# Altium project FPGA3.PrjPCB (part 1 of 2)
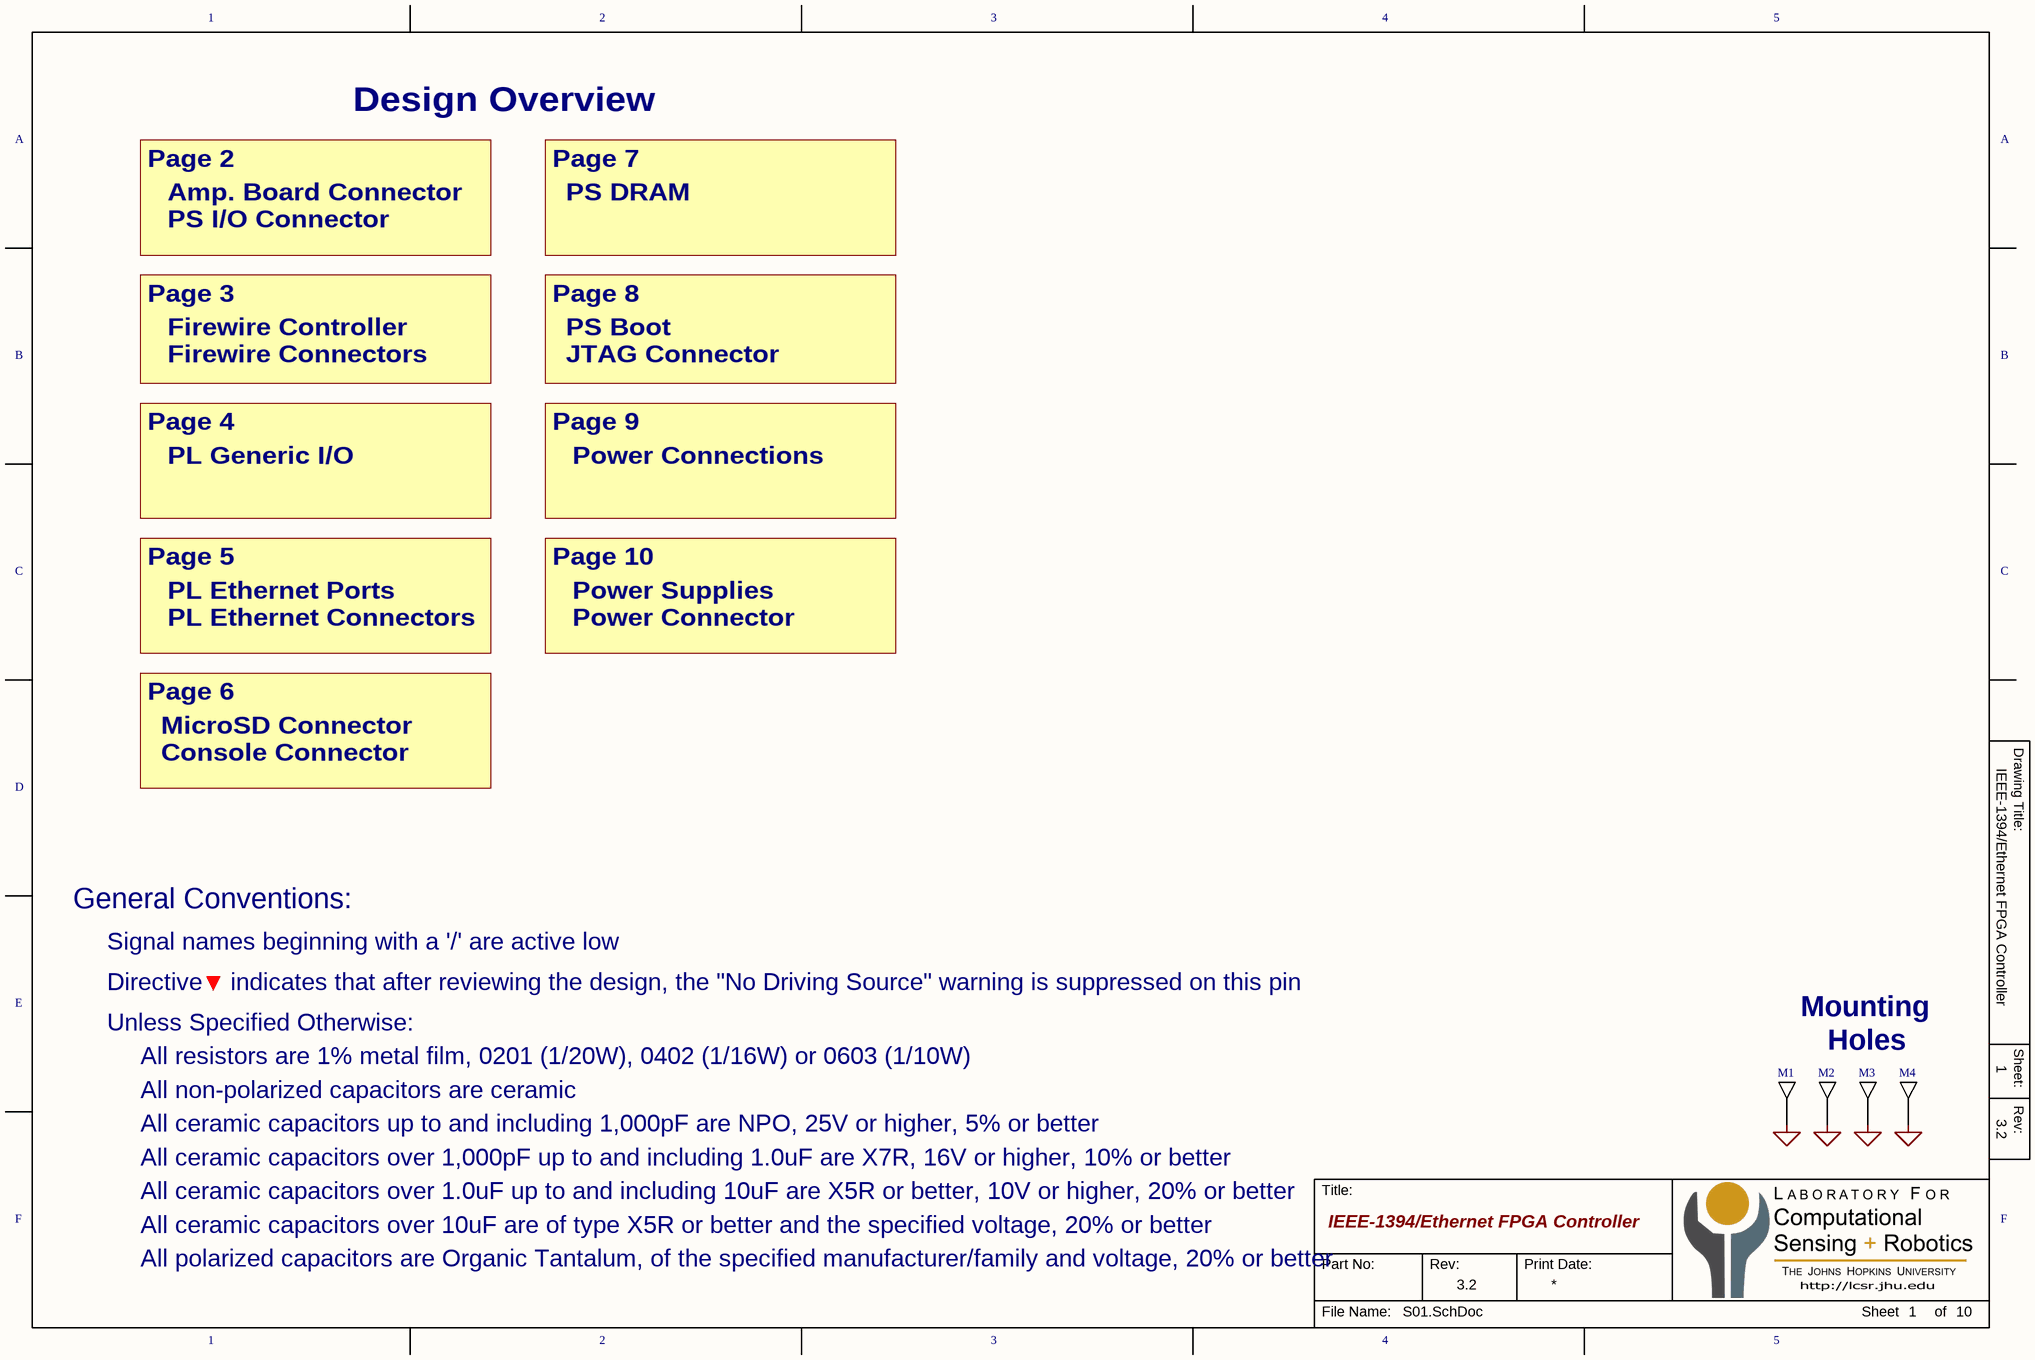
[diagram p0: S01.SchDoc]
10 sheets, 420 parts. Net scope: flat (ports and power ports of the same name join across sheets).
Board file: FPGA3.PcbDoc
Sheets:
  S01.SchDoc
  S02.SchDoc
  S03.SchDoc
  S04.SchDoc
  S05.SchDoc
  S06.SchDoc
  S07.SchDoc
  S08.SchDoc
  S09.SchDoc
  S10.SchDoc

## Sheet S01.SchDoc: IEEE-1394/Ethernet FPGA Controller
size 381 x 254 mm; Revision: 3.2; SheetNumber: 1; SheetTotal: 10; PageSetup: Record=PageOptions|CenterHorizontal=True|CenterVertical=True|PrintScale=1.08|XCorrection=1.00|YCorrection=1.00|PrintKind=1|BorderSize=5000000|LeftOffset=0|BottomOffset=0|Orientation=2|PaperLength=1000|PaperWidth=1000|Scale=100|PaperSource=7|PrintQuality=600|MediaType=1|DitherType=10|PrintScaleMode=1|PaperKind=Ledger|PaperIndex=3

### Parts
M1  MHOLE  [MHOLE4]  (value not drawn)  (no BOM)
M2  MHOLE  [MHOLE4]  (value not drawn)  (no BOM)
M3  MHOLE  [MHOLE4]  (value not drawn)  (no BOM)
M4  MHOLE  [MHOLE4]  (value not drawn)  (no BOM)

### Nets
GND: M1.1 M2.1 M3.1 M4.1

### Notes on the sheet
- Page 2
- Design Overview
- Page 7
- Amp. Board Connector
- PS I/O Connector
- PS DRAM
- Page 3
- Page 8
- Firewire Controller
- Firewire Connectors
- PS Boot
- JTAG Connector
- Page 4
- Page 9
- PL Generic I/O
- Power Connections
- Page 5
- Page 10
- PL Ethernet Connectors
- PL Ethernet Ports
- Power Connector
- Power Supplies
- Page 6
- Console Connector
- MicroSD Connector
- General Conventions:
- Signal names beginning with a '/' are active low
- Unless Specified Otherwise:
- Directive    indicates that after reviewing the design, the "No Driving Source" warning is suppressed on this pin
- Mounting
- All resistors are 1% metal film, 0201 (1/20W), 0402 (1/16W) or 0603 (1/10W)
- All non-polarized capacitors are ceramic
- Holes
- All ceramic capacitors up to and including 1,000pF are NPO, 25V or higher, 5% or better
- All ceramic capacitors over 1,000pF up to and including 1.0uF are X7R, 16V or higher, 10% or better
- All ceramic capacitors over 10uF are of type X5R or better and the specified voltage, 20% or better
- All ceramic capacitors over 1.0uF up to and including 10uF are X5R or better, 10V or higher, 20% or better
- All polarized capacitors are Organic Tantalum, of the specified manufacturer/family and voltage, 20% or better
- 1
- 2
- 3
- 4
- 5
- A
- B
- C
- Drawing Title:
- D
- E
- Sheet:
- Rev:
- F
- Title:
- Part No:
- Print Date:
- File Name:
- Sheet
- of

### Library data of the parts
M1-M4 = MHOLE: Mounting Hole

## Sheet S02.SchDoc: IEEE-1394/Ethernet FPGA Controller
size 381 x 254 mm; Revision: 3.2; SheetNumber: 2; SheetTotal: 10
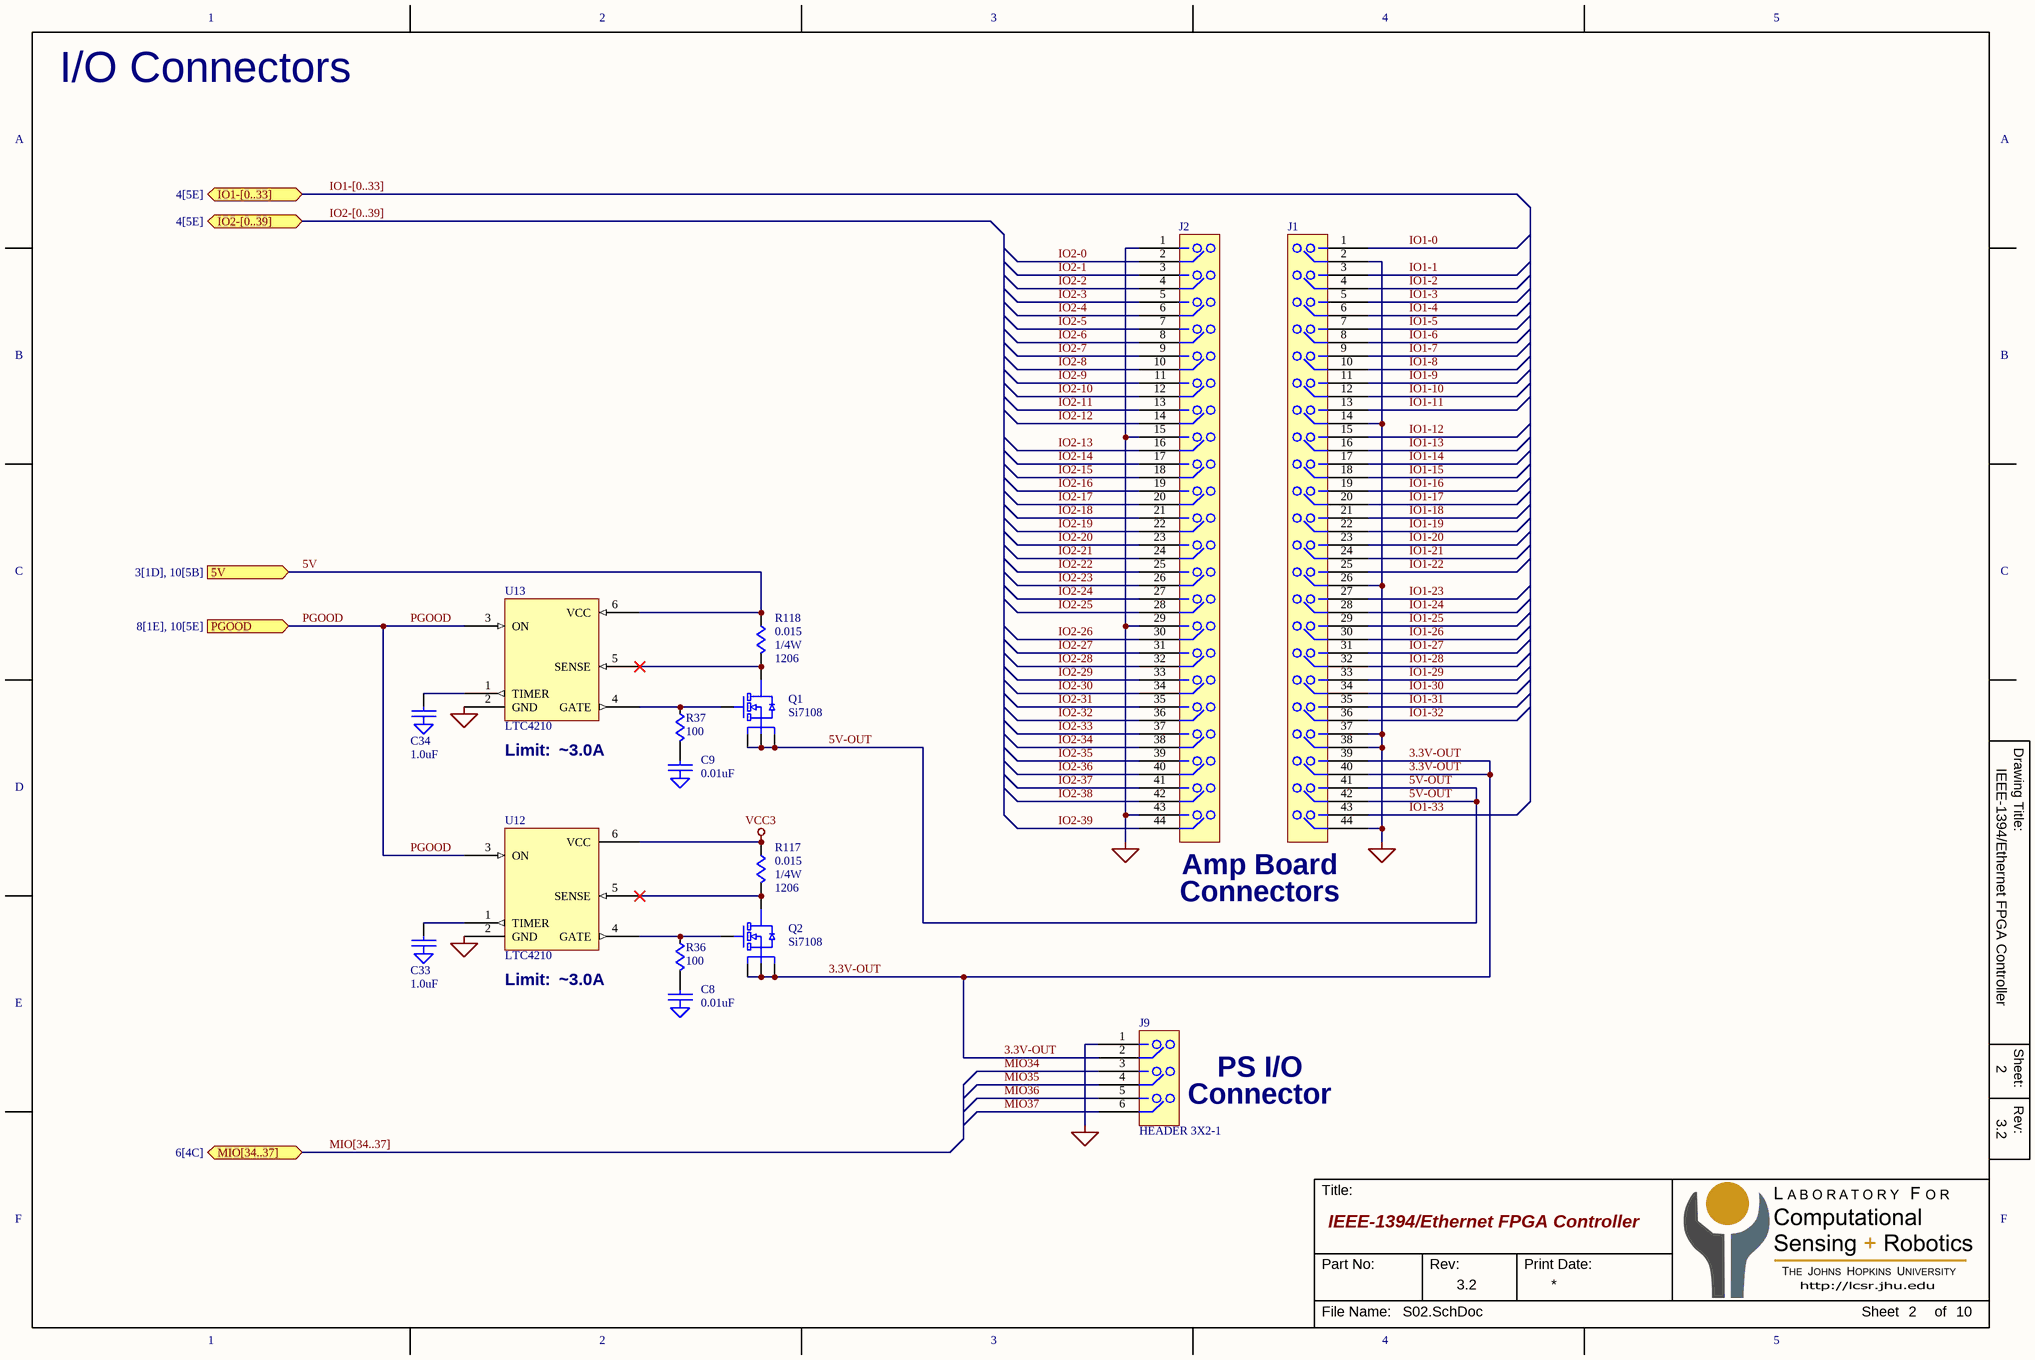
[diagram p1: S02.SchDoc]

### Parts
C8  0.01uF  [C0402]
C9  0.01uF  [C0402]
C33  1.0uF  [C0402]
C34  1.0uF  [C0402]
J1  HEADER 22x2-1  [HDR-22x2-2MM]  (value not drawn)
J2  HEADER 22x2-1  [HDR-22x2-2MM]  (value not drawn)
J9  HEADER 3X2-1  [HDR-3x2-2MM]
Q1  Si7108  [PowerPak-1212]
Q2  Si7108  [PowerPak-1212]
R36  100  [R0402]
R37  100  [R0402]
R117  0.015  Power: 1/4W  Type: 1206  [R1206]
R118  0.015  Power: 1/4W  Package: 1206  [R1206]
U12  LTC4210  [SOT-23-6]
U13  LTC4210  [SOT-23-6]

### Ports
5V (in, see 3[1D], 10[5B]), IO1-[0..33] (bidir, see 4[5E]), IO2-[0..39] (bidir, see 4[5E]), MIO[34..37] (bidir, see 6[4C]), PGOOD (in, see 8[1E], 10[5E])

### Nets
GND: C8.2(GND) C9.2(GND) C33.2(GND) C34.2(GND) J1.2 J1.14 J1.26 J1.37 J1.38 J1.44 J2.1 J2.15 J2.29 J2.43 J9.1 U12.2(GND) U13.2(GND)
VCC3: R117.1 U12.6(VCC)
3.3V-OUT: J1.39 J1.40 J9.2 Q2.1(S) Q2.2(S) Q2.3(S)  [project net 3.3V-OUT_2]
5V: R118.1 U13.6(VCC) ; port 5V
5V-OUT: J1.41 J1.42 Q1.1(S) Q1.2(S) Q1.3(S)  [project net 5V-OUT_2]
IO1-0: J1.1
IO1-1: J1.3
IO1-2: J1.4
IO1-3: J1.5
IO1-4: J1.6
IO1-5: J1.7
IO1-6: J1.8
IO1-7: J1.9
IO1-8: J1.10
IO1-9: J1.11
IO1-10: J1.12
IO1-11: J1.13
IO1-12: J1.15
IO1-13: J1.16
IO1-14: J1.17
IO1-15: J1.18
IO1-16: J1.19
IO1-17: J1.20
IO1-18: J1.21
IO1-19: J1.22
IO1-20: J1.23
IO1-21: J1.24
IO1-22: J1.25
IO1-23: J1.27
IO1-24: J1.28
IO1-25: J1.29
IO1-26: J1.30
IO1-27: J1.31
IO1-28: J1.32
IO1-29: J1.33
IO1-30: J1.34
IO1-31: J1.35
IO1-32: J1.36
IO1-33: J1.43
IO2-0: J2.2
IO2-1: J2.3
IO2-2: J2.4
IO2-3: J2.5
IO2-4: J2.6
IO2-5: J2.7
IO2-6: J2.8
IO2-7: J2.9
IO2-8: J2.10
IO2-9: J2.11
IO2-10: J2.12
IO2-11: J2.13
IO2-12: J2.14
IO2-13: J2.16
IO2-14: J2.17
IO2-15: J2.18
IO2-16: J2.19
IO2-17: J2.20
IO2-18: J2.21
IO2-19: J2.22
IO2-20: J2.23
IO2-21: J2.24
IO2-22: J2.25
IO2-23: J2.26
IO2-24: J2.27
IO2-25: J2.28
IO2-26: J2.30
IO2-27: J2.31
IO2-28: J2.32
IO2-29: J2.33
IO2-30: J2.34
IO2-31: J2.35
IO2-32: J2.36
IO2-33: J2.37
IO2-34: J2.38
IO2-35: J2.39
IO2-36: J2.40
IO2-37: J2.41
IO2-38: J2.42
IO2-39: J2.44
MIO34: J9.3
MIO35: J9.4
MIO36: J9.5
MIO37: J9.6
PGOOD: U12.3(ON) U13.3(ON) ; port PGOOD
NetC8_1: C8.1 R36.2
NetC9_1: C9.1 R37.2
NetC33_1: C33.1 U12.1(TIMER)
NetC34_1: C34.1 U13.1(TIMER)
NetQ1_4: Q1.4(G) R37.1 U13.4(GATE)
NetQ1_5: Q1.5(D) R118.2 U13.5(SENSE)
NetQ2_4: Q2.4(G) R36.1 U12.4(GATE)
NetQ2_5: Q2.5(D) R117.2 U12.5(SENSE)

### Buses and harness runs
bus IO1-[0..33] = port IO1-[0..33]
bus IO2-[0..39] = port IO2-[0..39]
bus MIO[34..37] = port MIO[34..37]

### Notes on the sheet
- I/O Connectors
- (near U13) Limit:
- (near U13) ~3.0A
- Amp Board
- Connectors
- (near U12) Limit:
- (near U12) ~3.0A
- PS I/O
- Connector
- 1
- 2
- 3
- 4
- 5
- A
- B
- C
- Drawing Title:
- D
- E
- Sheet:
- Rev:
- F
- Title:
- Part No:
- Print Date:
- File Name:
- Sheet
- of

### Library data of the parts
C8 C9 C33 C34 = CAP-GND
Q1 Q2 = MOSFET-N-PPACK
R36 R37 = R-MINI
R117 R118 = R

## Sheet S03.SchDoc: IEEE-1394/Ethernet FPGA Controller
size 381 x 254 mm; Revision: 3.2; SheetNumber: 3; SheetTotal: 10
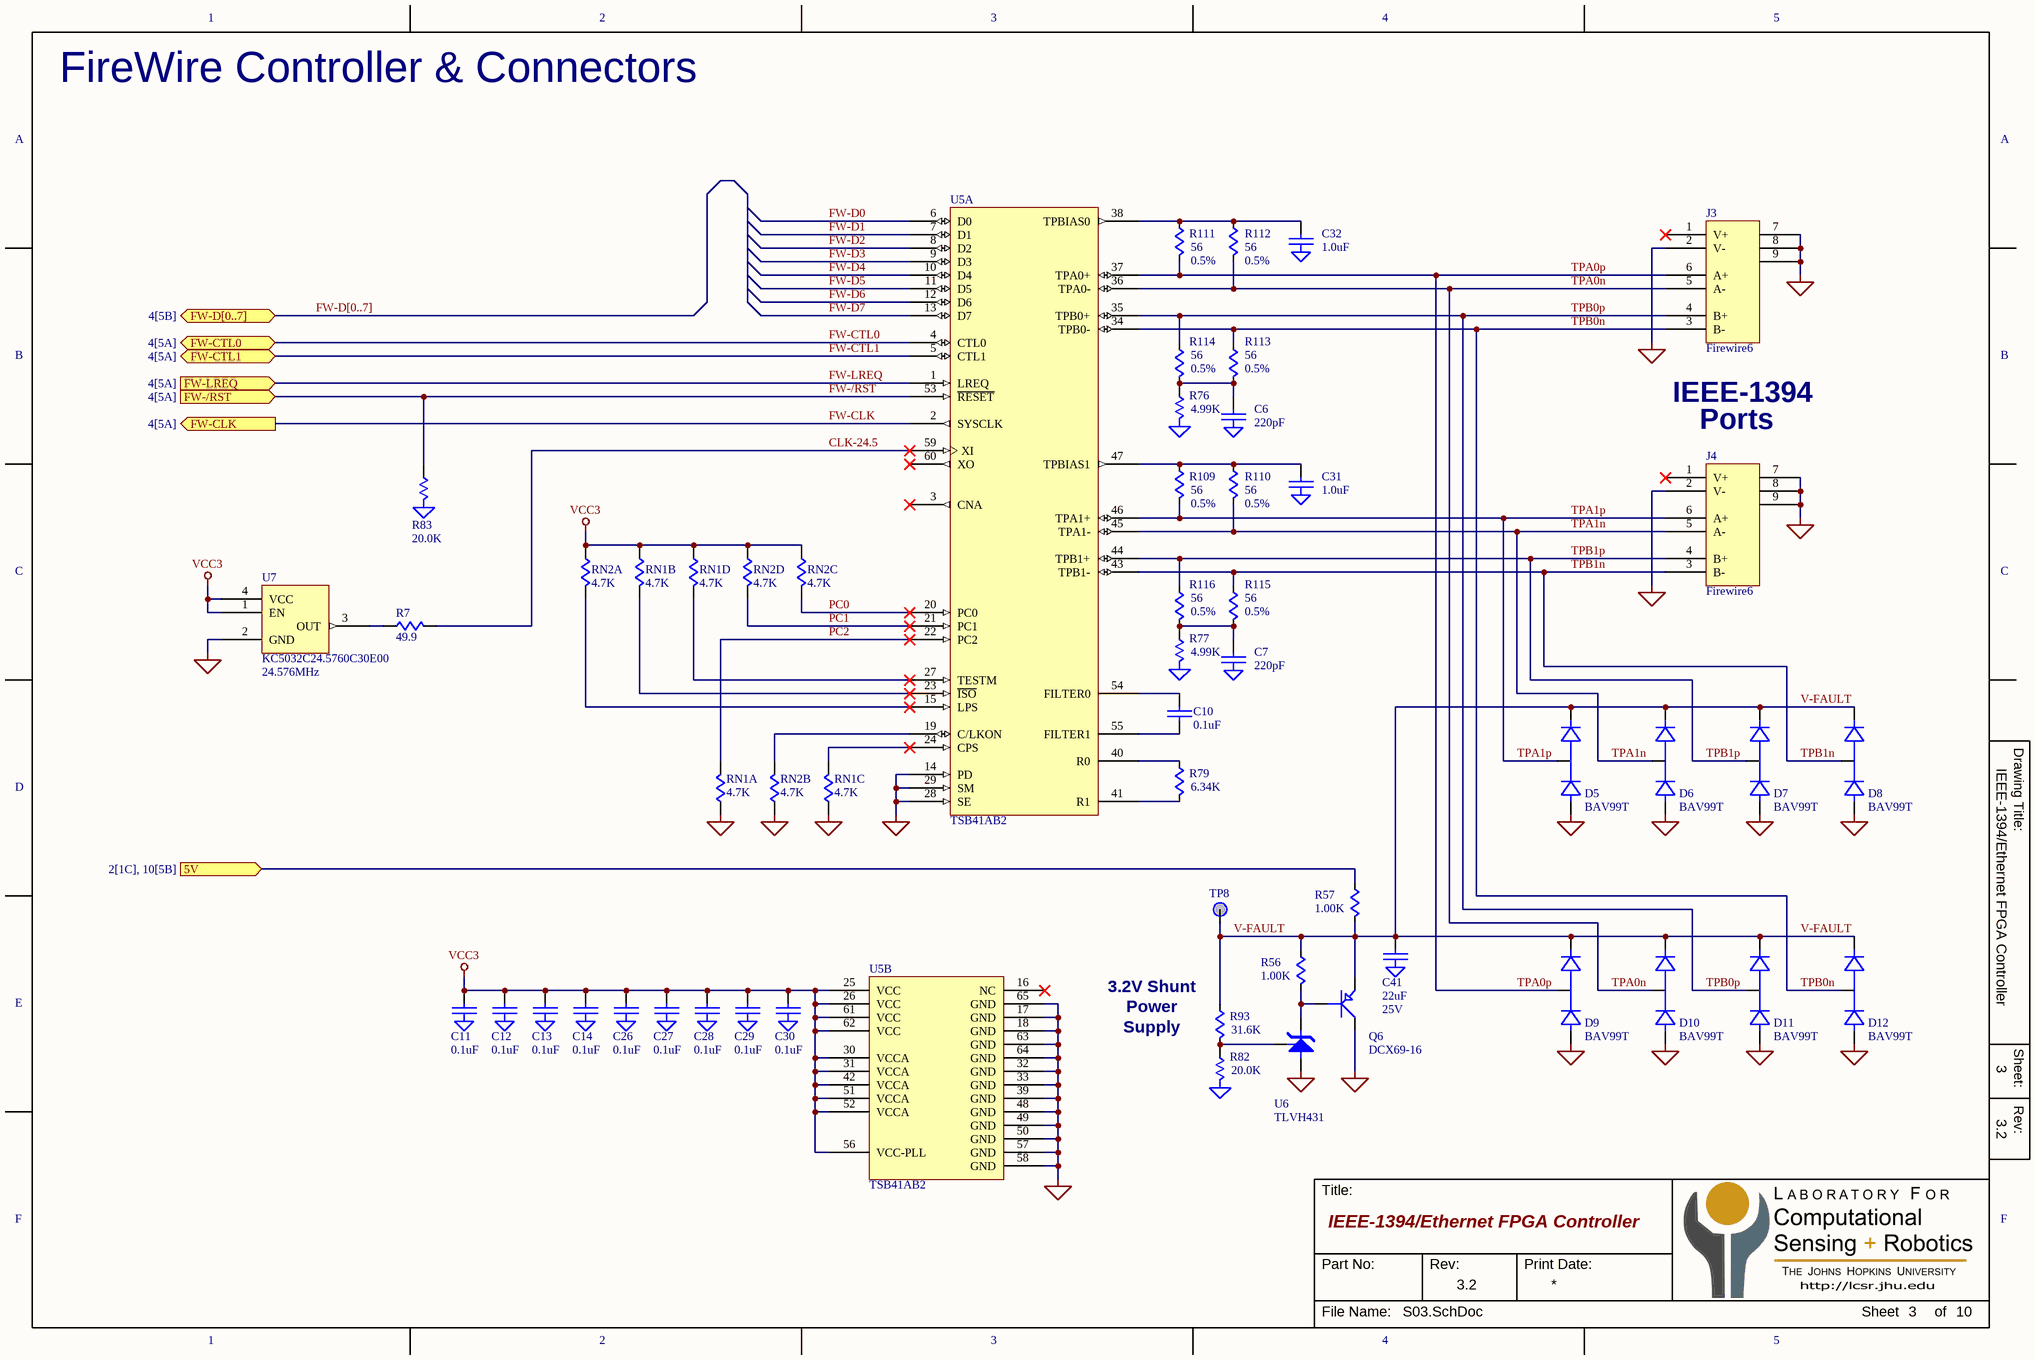
[diagram p2: S03.SchDoc]

### Parts
C6  220pF  [C0603]
C7  220pF  [C0603]
C10  0.1uF  [C0402]
C11  0.1uF  [C0402]
C12  0.1uF  [C0402]
C13  0.1uF  [C0402]
C14  0.1uF  [C0402]
C26  0.1uF  [C0402]
C27  0.1uF  [C0402]
C28  0.1uF  [C0402]
C29  0.1uF  [C0402]
C30  0.1uF  [C0402]
C31  1.0uF  [C0402]
C32  1.0uF  [C0402]
C41  22uF  [C0805]
D5  BAV99T  [SOT-523]
D6  BAV99T  [SOT-523]
D7  BAV99T  [SOT-523]
D8  BAV99T  [SOT-523]
D9  BAV99T  [SOT-523]
D10  BAV99T  [SOT-523]
D11  BAV99T  [SOT-523]
D12  BAV99T  [SOT-523]
J3  Firewire6  [Firewire6-RA]
J4  Firewire6  [Firewire6-RA]
Q6  DCX69-16  [SOT-89]
R7  49.9  [R0201]
R56  1.00K  [R0402]
R57  1.00K  [R0402]
R76  4.99K  [R0402]
R77  4.99K  [R0402]
R79  6.34K  [R0402]
R82  20.0K  [R0402]
R83  20.0K  [R0402]
R93  31.6K  [R0402]
R109  56  Toll: 0.5%  [R0603]
R110  56  Toll: 0.5%  [R0603]
R111  56  Toll: 0.5%  [R0603]
R112  56  Toll: 0.5%  [R0603]
R113  56  Toll: 0.5%  [R0603]
R114  56  Toll: 0.5%  [R0603]
R115  56  Toll: 0.5%  [R0603]
R116  56  Toll: 0.5%  [R0603]
RN1  4.7K  [RN-742C083]  (parts A,B,C,D of 4)
RN2  4.7K  [RN-742C083]  (parts A,B,C,D of 4)
TP8  PAD  [PAD25-SM]  (value not drawn)  (no BOM)
U5  TSB41AB2  [PQFP-65]  (parts A,B of 2)
U6  TLVH431  [SC70-6]
U7  KC5032C24.5760C30E00  Freq: 24.576MHz  [OSC-3x5MM]

### Ports
5V (in, see 2[1C], 10[5B]), FW-/RST (in, see 4[5A]), FW-CLK (out, see 4[5A]), FW-CTL0 (bidir, see 4[5A]), FW-CTL1 (bidir, see 4[5A]), FW-D[0..7] (bidir, see 4[5B]), FW-LREQ (in, see 4[5A])

### Nets
GND: C6.2(GND) C7.2(GND) C11.2(GND) C12.2(GND) C13.2(GND) C14.2(GND) C26.2(GND) C27.2(GND) C28.2(GND) C29.2(GND) C30.2(GND) C31.2(GND) C32.2(GND) C41.2(GND) D5.1(A) D6.1(A) D7.1(A) D8.1(A) D9.1(A) D10.1(A) D11.1(A) D12.1(A) J3.2(V-) J3.7(CHASIS) J3.8(CHASIS) J3.9(CHASIS) J4.2(V-) J4.7(CHASIS) J4.8(CHASIS) J4.9(CHASIS) Q6.3(C) R76.2(GND) R77.2(GND) R82.2(GND) R83.2(GND) RN1.1 RN1.3 RN2.2 U5.14(PD) U5.17(GND) U5.18(GND) U5.28(SE) U5.29(SM) U5.32(GND) U5.33(GND) U5.39(GND) U5.48(GND) U5.49(GND) U5.50(GND) U5.57(GND) U5.58(GND) U5.63(GND) U5.64(GND) U5.65(GND) U6.6(A) U7.2(GND)
VCC3: C11.1 C12.1 C13.1 C14.1 C26.1 C27.1 C28.1 C29.1 C30.1 RN1.2 RN1.4 RN2.1 RN2.3 RN2.4 U5.25(VCC) U5.26(VCC) U5.30(VCCA) U5.31(VCCA) U5.42(VCCA) U5.51(VCCA) U5.52(VCCA) U5.56(VCC-PLL) U5.61(VCC) U5.62(VCC) U7.1(EN) U7.4(VCC)
5V: R57.1 ; port 5V
CLK-24.5: R7.2 U5.59(XI)  [project net CLK-24.5_3]
FW-/RST: R83.1 U5.53(~{RESET}) ; port FW-/RST
FW-CLK: U5.2(SYSCLK) ; port FW-CLK
FW-CTL0: U5.4(CTL0) ; port FW-CTL0
FW-CTL1: U5.5(CTL1) ; port FW-CTL1
FW-D0: U5.6(D0)
FW-D1: U5.7(D1)
FW-D2: U5.8(D2)
FW-D3: U5.9(D3)
FW-D4: U5.10(D4)
FW-D5: U5.11(D5)
FW-D6: U5.12(D6)
FW-D7: U5.13(D7)
FW-LREQ: U5.1(LREQ) ; port FW-LREQ
PC0: RN2.6 U5.20(PC0)  [project net PC0_3]
PC1: RN2.5 U5.21(PC1)  [project net PC1_3]
PC2: RN1.8 U5.22(PC2)  [project net PC2_3]
TPA0n: D10.3(COM) J3.5(A-) R112.2 U5.36(TPA0-)  [project net TPA0n_3]
TPA0p: D9.3(COM) J3.6(A+) R111.2 U5.37(TPA0+)  [project net TPA0p_3]
TPA1n: D6.3(COM) J4.5(A-) R110.2 U5.45(TPA1-)  [project net TPA1n_3]
TPA1p: D5.3(COM) J4.6(A+) R109.2 U5.46(TPA1+)  [project net TPA1p_3]
TPB0n: D12.3(COM) J3.3(B-) R113.1 U5.34(TPB0-)  [project net TPB0n_3]
TPB0p: D11.3(COM) J3.4(B+) R114.1 U5.35(TPB0+)  [project net TPB0p_3]
TPB1n: D8.3(COM) J4.3(B-) R115.1 U5.43(TPB1-)  [project net TPB1n_3]
TPB1p: D7.3(COM) J4.4(B+) R116.1 U5.44(TPB1+)  [project net TPB1p_3]
V-FAULT: C41.1 D5.2(C) D6.2(C) D7.2(C) D8.2(C) D9.2(C) D10.2(C) D11.2(C) D12.2(C) Q6.2(E) R56.1 R57.2 R93.1 TP8.1  [project net V-FAULT_3]
NetC6_1: C6.1 R76.1 R113.2 R114.2
NetC7_1: C7.1 R77.1 R115.2 R116.2
NetC10_1: C10.1 U5.54(FILTER0)
NetC10_2: C10.2 U5.55(FILTER1)
NetC31_1: C31.1 R109.1 R110.1 U5.47(TPBIAS1)
NetC32_1: C32.1 R111.1 R112.1 U5.38(TPBIAS0)
NetQ6_1: Q6.1(B) R56.2 U6.1(C)
NetR7_1: R7.1 U7.3(OUT)
NetR79_1: R79.1 U5.40(R0)
NetR79_2: R79.2 U5.41(R1)
NetR82_1: R82.1 R93.2 U6.3(ADJ)
NetRN1_5: RN1.5 U5.27(TESTM)
NetRN1_6: RN1.6 U5.24(CPS)
NetRN1_7: RN1.7 U5.23(~{ISO})
NetRN2_7: RN2.7 U5.19(C/LKON)
NetRN2_8: RN2.8 U5.15(LPS)

Not connected (* = marked no-connect by the designer): J3 1(V+)*; J4 1(V+)*; U5 3(CNA)* 16(NC)* 60(XO)*

### Buses and harness runs
bus FW-D[0..7] = port FW-D[0..7]

### Notes on the sheet
- FireWire Controller & Connectors
- IEEE-1394
- (near J4) Ports
- (near R93) 3.2V Shunt
- Power
- Supply
- 1
- 2
- 3
- 4
- 5
- A
- B
- C
- Drawing Title:
- D
- E
- Sheet:
- Rev:
- F
- Title:
- Part No:
- Print Date:
- File Name:
- Sheet
- of
- (in symbol CAP-GND) 25V

### Library data of the parts
C6 C7 C11-C14 C26-C32 C41 = CAP-GND
C10 = CAP
D5-D12 = DIODE-2/SER
Q6 = PNP-SM
R7 = R
R56 R57 R79 R93 R109-R116 = R-MINI
R76 R77 R82 R83 = R-GND
RN1 RN2 = RN-DISC-SM-4X
U5 = TSB41AB2: IEEE 1394a-2000 Two-port Transceiver/Arbiter
U6 = TLVH431-SC70
U7 = OSCILATOR

## Sheet S04.SchDoc: IEEE-1394/Ethernet FPGA Controller
size 381 x 254 mm; Revision: 3.2; SheetNumber: 4; SheetTotal: 10
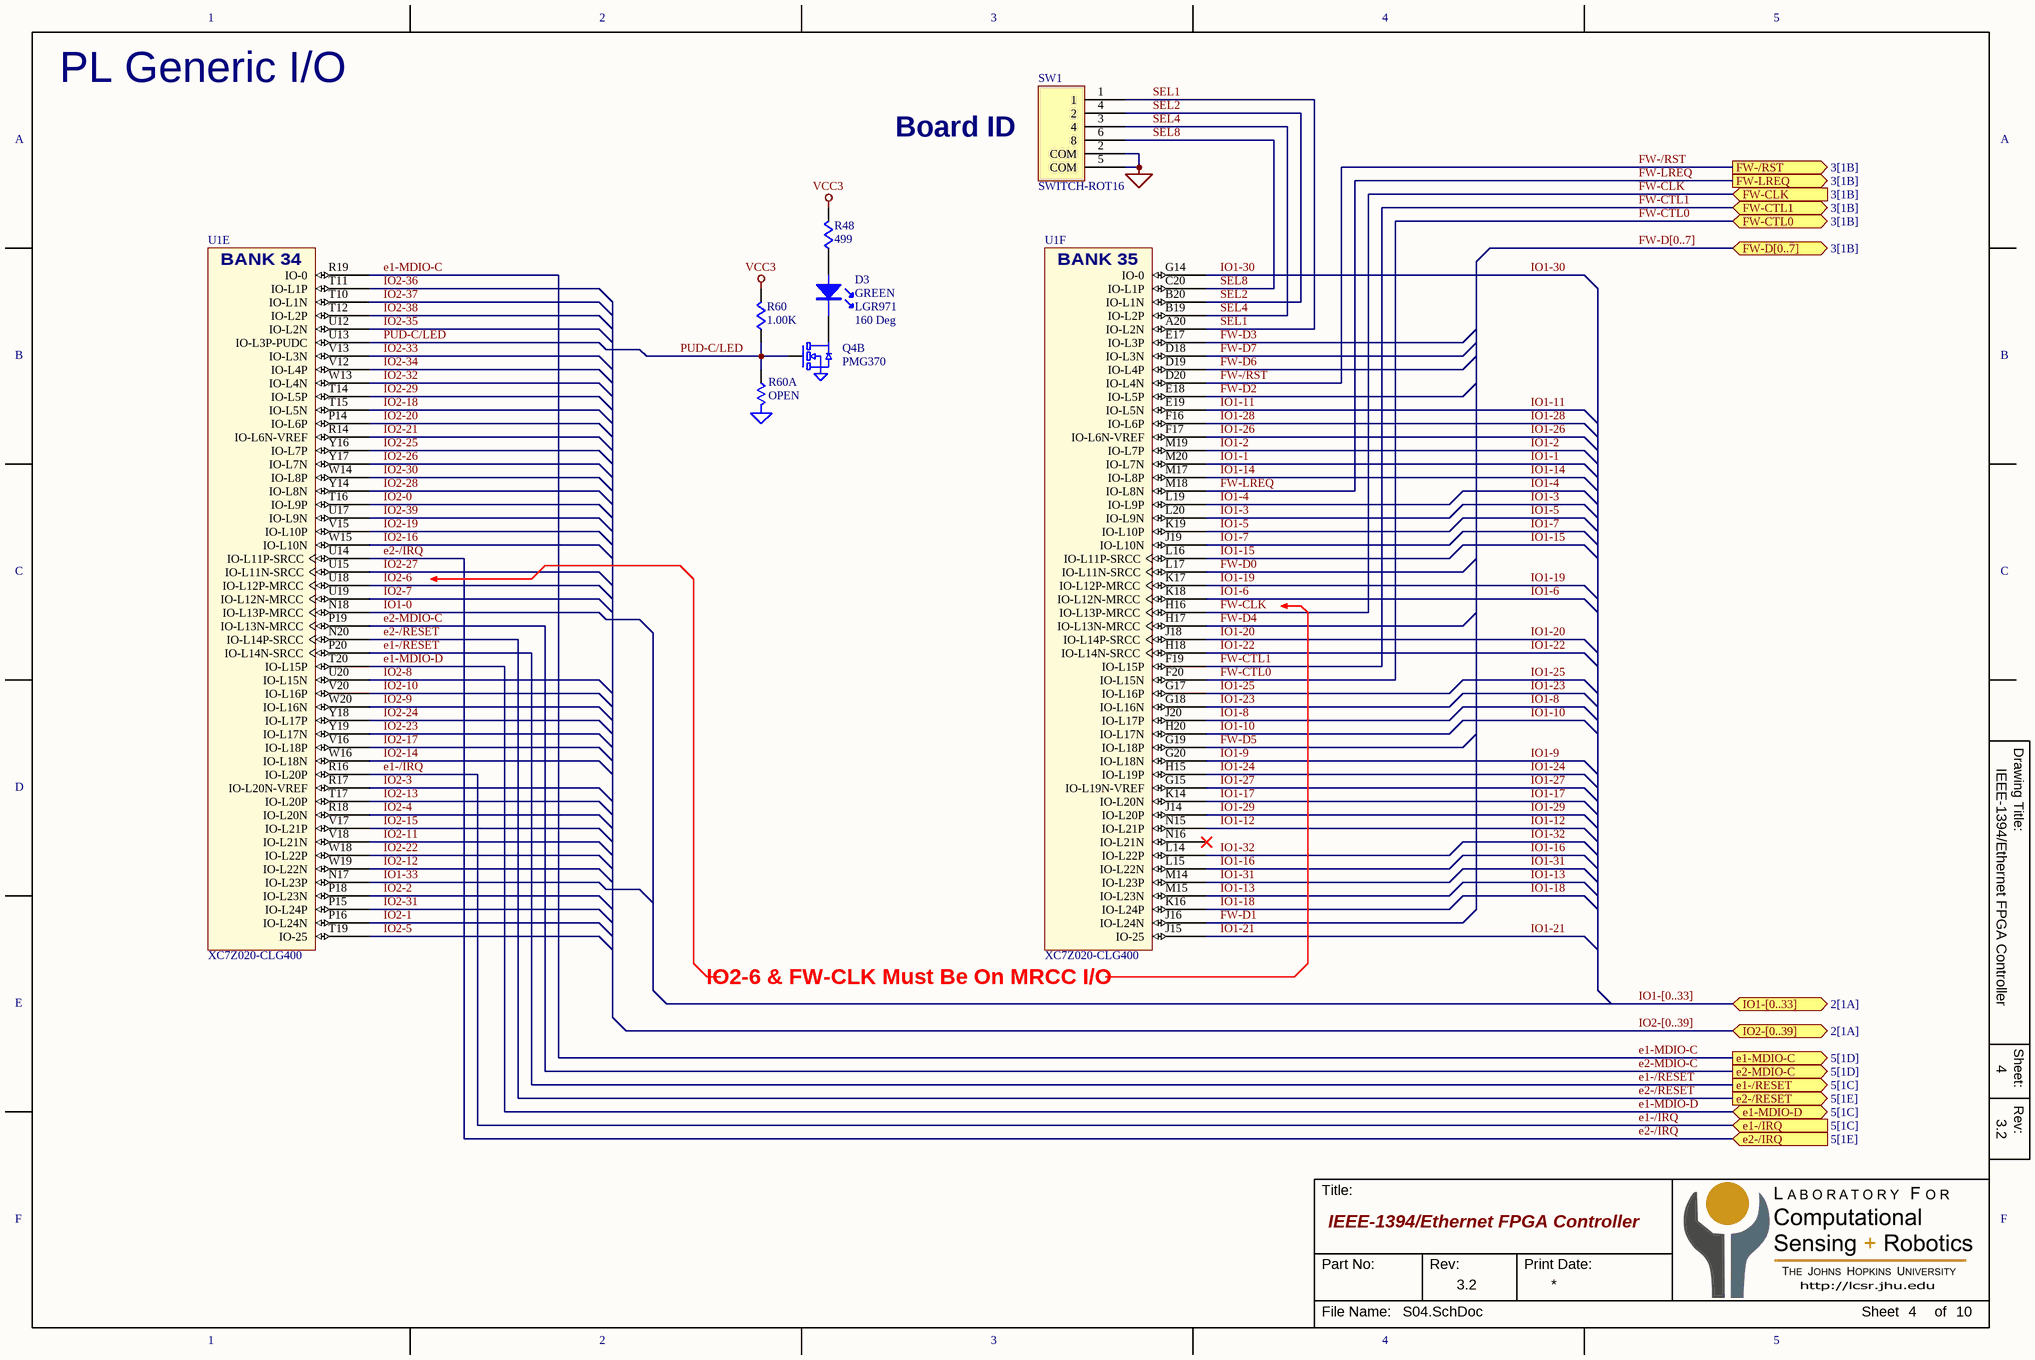
[diagram p3: S04.SchDoc]

### Parts
D3  Color: GREEN  P/N: LGR971  Angle: 160 Deg  [LED-0805]  (hidden comment: LED)
Q4  PMG370  [SC70-6-NP]  (part B of 2)
R48  499  [R0402]
R60  1.00K  [R0402]
R60A  OPEN  [R0402]
SW1  SWITCH-ROT16  [SW-ROT-10MM-TH]
U1  XC7Z020-CLG400  [BGA-400-08mm]  (parts E,F of 9)

### Ports
e1-/IRQ (in, see 5[1C]), e1-/RESET (out, see 5[1C]), e1-MDIO-C (out, see 5[1D]), e1-MDIO-D (bidir, see 5[1C]), e2-/IRQ (in, see 5[1E]), e2-/RESET (out, see 5[1E]), e2-MDIO-C (out, see 5[1D]), FW-/RST (out, see 3[1B]), FW-CLK (in, see 3[1B]), FW-CTL0 (bidir, see 3[1B]), FW-CTL1 (bidir, see 3[1B]), FW-D[0..7] (bidir, see 3[1B]), FW-LREQ (out, see 3[1B]), IO1-[0..33] (bidir, see 2[1A]), IO2-[0..39] (bidir, see 2[1A])

### Nets
GND: Q4.4(S2) R60A.2(GND) SW1.2(COM) SW1.5(COM)
VCC3: R48.2 R60.2
e1-/IRQ: U1.R16(IO-L20P) ; port e1-/IRQ
e1-/RESET: U1.P20(IO-L14N-SRCC) ; port e1-/RESET
e1-MDIO-C: U1.R19(IO-0) ; port e1-MDIO-C
e1-MDIO-D: U1.T20(IO-L15P) ; port e1-MDIO-D
e2-/IRQ: U1.U14(IO-L11P-SRCC) ; port e2-/IRQ
e2-/RESET: U1.N20(IO-L14P-SRCC) ; port e2-/RESET
e2-MDIO-C: U1.P19(IO-L13N-MRCC) ; port e2-MDIO-C
FW-/RST: U1.D20(IO-L4N) ; port FW-/RST
FW-CLK: U1.H16(IO-L13P-MRCC) ; port FW-CLK
FW-CTL0: U1.F20(IO-L15N) ; port FW-CTL0
FW-CTL1: U1.F19(IO-L15P) ; port FW-CTL1
FW-D0: U1.L17(IO-L11N-SRCC)
FW-D1: U1.J16(IO-L24N)
FW-D2: U1.E18(IO-L5P)
FW-D3: U1.E17(IO-L3P)
FW-D4: U1.H17(IO-L13N-MRCC)
FW-D5: U1.G19(IO-L18P)
FW-D6: U1.D19(IO-L4P)
FW-D7: U1.D18(IO-L3N)
FW-LREQ: U1.M18(IO-L8N) ; port FW-LREQ
IO1-0: U1.N18(IO-L13P-MRCC)
IO1-1: U1.M20(IO-L7N)
IO1-2: U1.M19(IO-L7P)
IO1-3: U1.L20(IO-L9N)
IO1-4: U1.L19(IO-L9P)
IO1-5: U1.K19(IO-L10P)
IO1-6: U1.K18(IO-L12N-MRCC)
IO1-7: U1.J19(IO-L10N)
IO1-8: U1.J20(IO-L17P)
IO1-9: U1.G20(IO-L18N)
IO1-10: U1.H20(IO-L17N)
IO1-11: U1.E19(IO-L5N)
IO1-12: U1.N15(IO-L21P)
IO1-13: U1.M15(IO-L23N)
IO1-14: U1.M17(IO-L8P)
IO1-15: U1.L16(IO-L11P-SRCC)
IO1-16: U1.L15(IO-L22N)
IO1-17: U1.K14(IO-L20N)
IO1-18: U1.K16(IO-L24P)
IO1-19: U1.K17(IO-L12P-MRCC)
IO1-20: U1.J18(IO-L14P-SRCC)
IO1-21: U1.J15(IO-25)
IO1-22: U1.H18(IO-L14N-SRCC)
IO1-23: U1.G18(IO-L16N)
IO1-24: U1.H15(IO-L19P)
IO1-25: U1.G17(IO-L16P)
IO1-26: U1.F17(IO-L6N-VREF)
IO1-27: U1.G15(IO-L19N-VREF)
IO1-28: U1.F16(IO-L6P)
IO1-29: U1.J14(IO-L20P)
IO1-30: U1.G14(IO-0)
IO1-31: U1.M14(IO-L23P)
IO1-32: U1.L14(IO-L22P)
IO1-33: U1.N17(IO-L23P)
IO2-0: U1.T16(IO-L9P)
IO2-1: U1.P16(IO-L24N)
IO2-2: U1.P18(IO-L23N)
IO2-3: U1.R17(IO-L20N-VREF)
IO2-4: U1.R18(IO-L20N)
IO2-5: U1.T19(IO-25)
IO2-6: U1.U18(IO-L12P-MRCC)
IO2-7: U1.U19(IO-L12N-MRCC)
IO2-8: U1.U20(IO-L15N)
IO2-9: U1.W20(IO-L16N)
IO2-10: U1.V20(IO-L16P)
IO2-11: U1.V18(IO-L21N)
IO2-12: U1.W19(IO-L22N)
IO2-13: U1.T17(IO-L20P)
IO2-14: U1.W16(IO-L18N)
IO2-15: U1.V17(IO-L21P)
IO2-16: U1.W15(IO-L10N)
IO2-17: U1.V16(IO-L18P)
IO2-18: U1.T15(IO-L5N)
IO2-19: U1.V15(IO-L10P)
IO2-20: U1.P14(IO-L6P)
IO2-21: U1.R14(IO-L6N-VREF)
IO2-22: U1.W18(IO-L22P)
IO2-23: U1.Y19(IO-L17N)
IO2-24: U1.Y18(IO-L17P)
IO2-25: U1.Y16(IO-L7P)
IO2-26: U1.Y17(IO-L7N)
IO2-27: U1.U15(IO-L11N-SRCC)
IO2-28: U1.Y14(IO-L8N)
IO2-29: U1.T14(IO-L5P)
IO2-30: U1.W14(IO-L8P)
IO2-31: U1.P15(IO-L24P)
IO2-32: U1.W13(IO-L4N)
IO2-33: U1.V13(IO-L3N)
IO2-34: U1.V12(IO-L4P)
IO2-35: U1.U12(IO-L2N)
IO2-36: U1.T11(IO-L1P)
IO2-37: U1.T10(IO-L1N)
IO2-38: U1.T12(IO-L2P)
IO2-39: U1.U17(IO-L9N)
PUD-C/LED: Q4.5(G2) R60.1 R60A.1 U1.U13(IO-L3P-PUDC)  [project net PUD-C/LED_4]
SEL1: SW1.1 U1.A20(IO-L2N)  [project net SEL1_4]
SEL2: SW1.4(2) U1.B20(IO-L1N)  [project net SEL2_4]
SEL4: SW1.3(4) U1.B19(IO-L2P)  [project net SEL4_4]
SEL8: SW1.6(8) U1.C20(IO-L1P)  [project net SEL8_4]
NetD3_1: D3.1(C) Q4.3(D2)
NetD3_2: D3.2(A) R48.1

Not connected (* = marked no-connect by the designer): U1 N16(IO-L21N)*

### Buses and harness runs
bus FW-D[0..7] = port FW-D[0..7]
bus IO1-[0..33] = port IO1-[0..33]
bus IO2-[0..39] = port IO2-[0..39]

### Notes on the sheet
- PL Generic I/O
- Board ID
- IO2-6 & FW-CLK Must Be On MRCC I/O
- 1
- 2
- 3
- 4
- 5
- A
- B
- C
- Drawing Title:
- D
- E
- Sheet:
- Rev:
- F
- Title:
- Part No:
- Print Date:
- File Name:
- Sheet
- of
- (in symbol XC7Z020-CLG400, part E) BANK 34
- (in symbol XC7Z020-CLG400, part F) BANK 35

### Library data of the parts
Q4 = MOSFET-N-DUAL6
R48 R60 = R
R60A = R-GND

## Sheet S05.SchDoc: IEEE-1394/Ethernet FPGA Controller
size 381 x 254 mm; Revision: 3.2; SheetNumber: 5; SheetTotal: 10
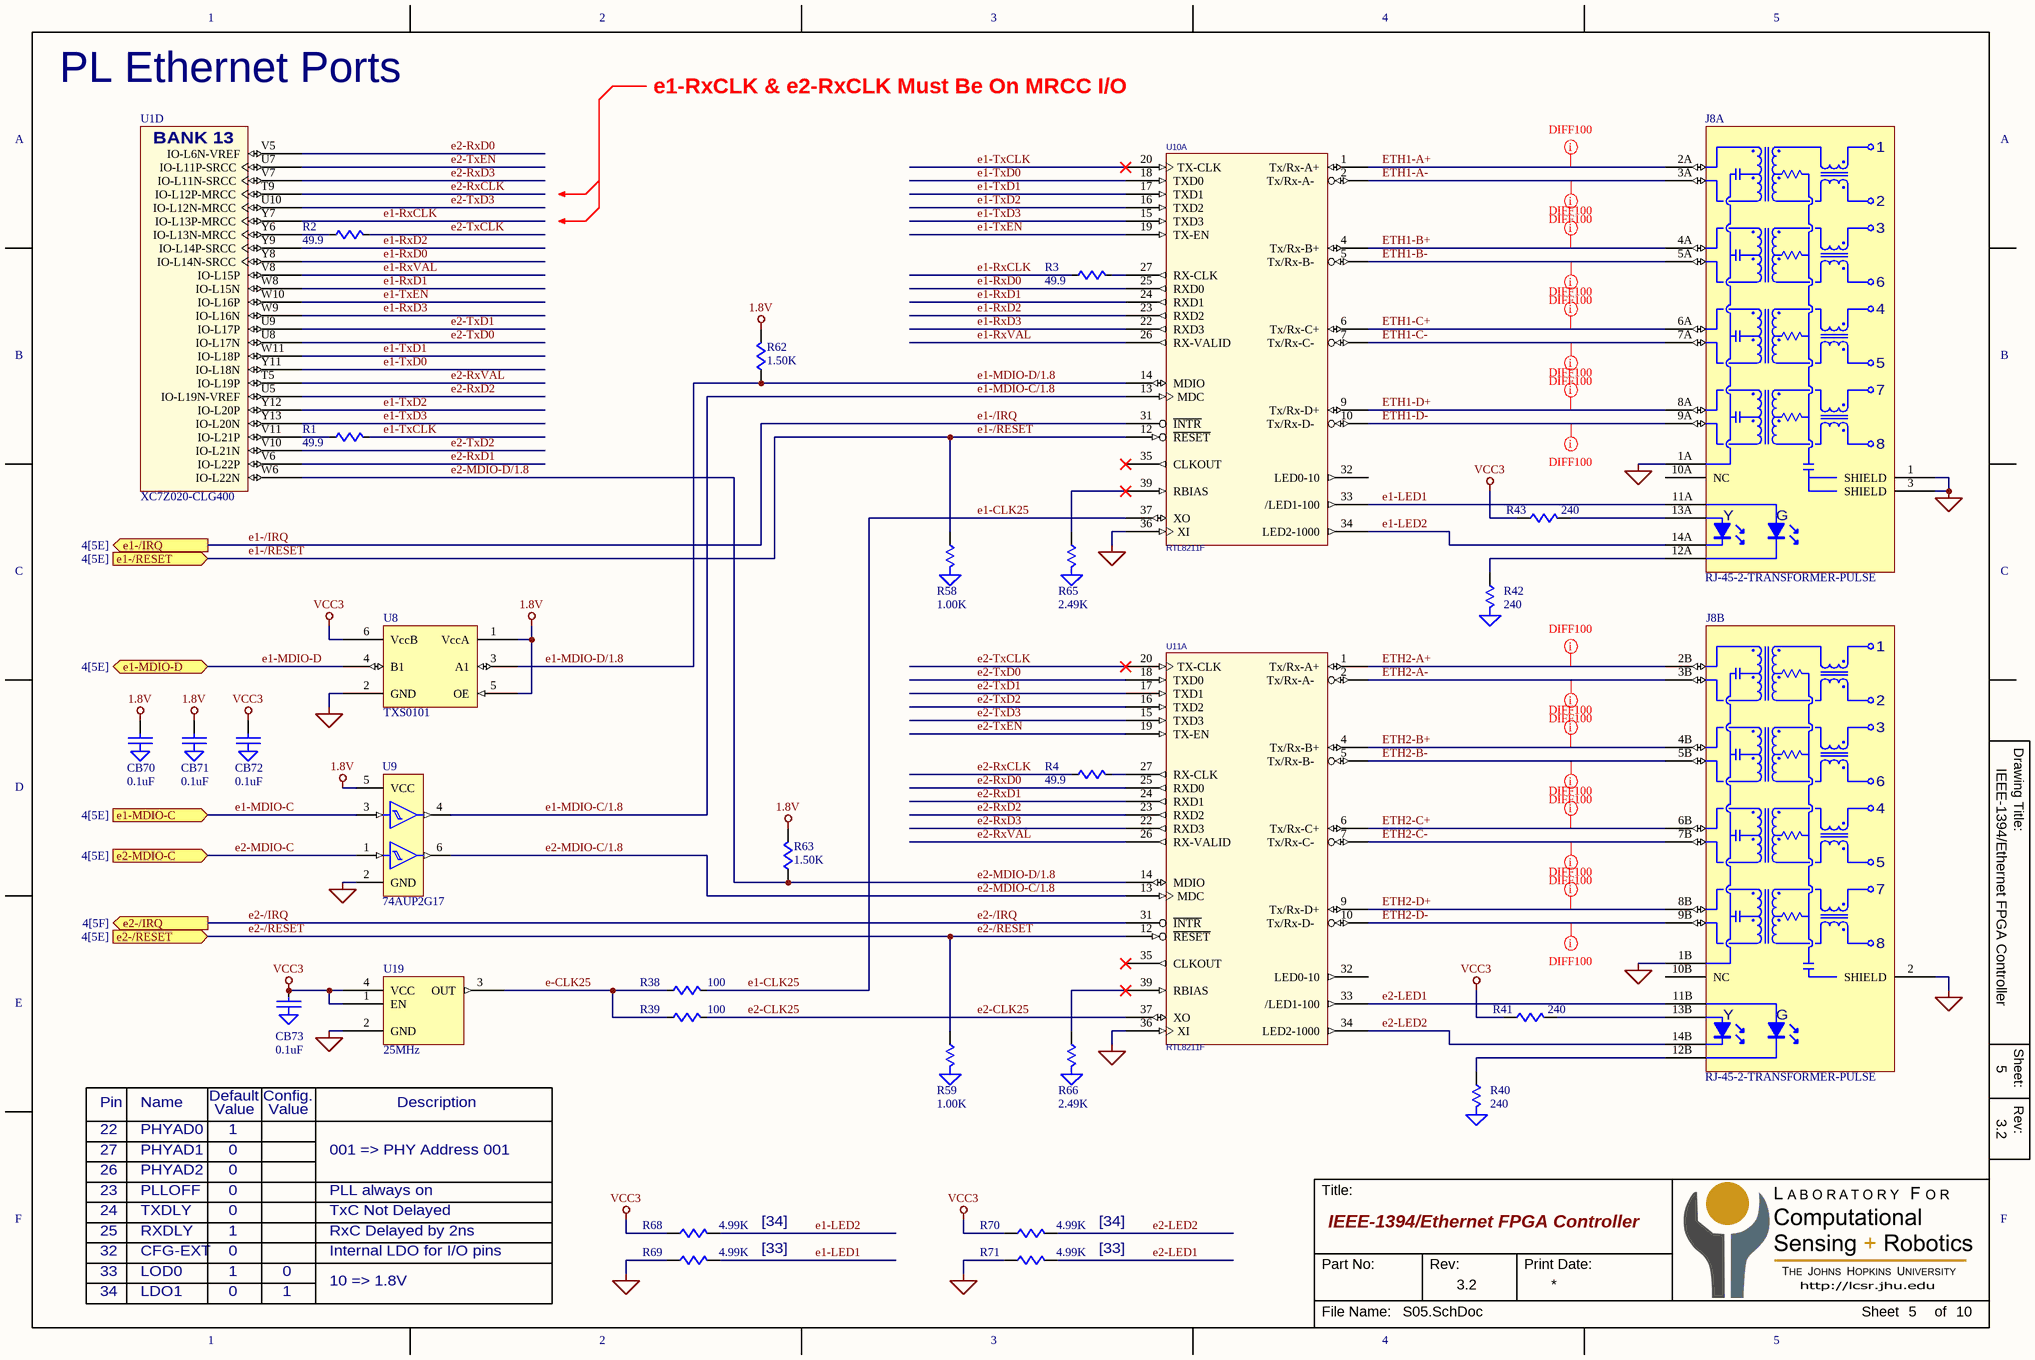
[diagram p4: S05.SchDoc]

### Parts
CB70  0.1uF  [C0201]
CB71  0.1uF  [C0201]
CB72  0.1uF  [C0201]
CB73  0.1uF  [C0201]
J8  RJ-45-2-TRANSFORMER-PULSE  [CONN-RJ-45-DUAL-PULSE-JXD0-2015NL]  (parts A,B of 2)
R1  49.9  [R0201]
R2  49.9  [R0201]
R3  49.9  [R0201]
R4  49.9  [R0201]
R38  100  [R0402]
R39  100  [R0402]
R40  240  [R0402]
R41  240  [R0402]
R42  240  [R0402]
R43  240  [R0402]
R58  1.00K  [R0402]
R59  1.00K  [R0402]
R62  1.50K  [R0402]
R63  1.50K  [R0402]
R65  2.49K  [R0402]
R66  2.49K  [R0402]
R68  4.99K  [R0402]
R69  4.99K  [R0402]
R70  4.99K  [R0402]
R71  4.99K  [R0402]
U1  XC7Z020-CLG400  [BGA-400-08mm]  (part D of 9)
U8  TXS0101  [SC70-6]
U9  74AUP2G17  [SC70-6]
U10  RTL8211F  [QFN-40-5MM]  (part A of 2)
U11  RTL8211F  [QFN-40-5MM]  (part A of 2)
U19  25MHz  [OSC-2x2.5mm]

### Ports
e1-/IRQ (out, see 4[5E]), e1-/RESET (in, see 4[5E]), e1-MDIO-C (in, see 4[5E]), e1-MDIO-D (bidir, see 4[5E]), e2-/IRQ (out, see 4[5F]), e2-/RESET (in, see 4[5E]), e2-MDIO-C (in, see 4[5E])

### Nets
1.8V: CB70.1 CB71.1 R62.2 R63.2 U8.1(VccA) U8.5(OE) U9.5(VCC)
GND: CB70.2(GND) CB71.2(GND) CB72.2(GND) CB73.2(GND) J8.1(SHIELD) J8.1A(GND) J8.1B(GND) J8.2(SHIELD) J8.3(SHIELD) R40.2(GND) R42.2(GND) R58.2(GND) R59.2(GND) R65.2(GND) R66.2(GND) R69.1 R71.1 U8.2(GND) U9.2(GND) U10.36(XI) U11.36(XI) U19.2(GND)
VCC3: CB72.1 CB73.1 R41.1 R43.1 R68.1 R70.1 U8.6(VccB) U19.1(EN) U19.4(VCC)
e1-/IRQ: U10.31(~{INTR}) ; port e1-/IRQ
e1-/RESET: R58.1 U10.12(~{RESET}) ; port e1-/RESET
e1-CLK25: R38.2 U10.37(XO)  [project net e1-CLK25_5]
e1-LED1: J8.11A(A(G)) R69.2 U10.33(/LED1-100)  [project net e1-LED1_5]
e1-LED2: J8.14A(K(Y)) R68.2 U10.34(LED2-1000)  [project net e1-LED2_5]
e1-MDIO-C: U9.3 ; port e1-MDIO-C
e1-MDIO-C/1.8: U9.4 U10.13(MDC)  [project net e1-MDIO-C/1.8_5]
e1-MDIO-D: U8.4(B1) ; port e1-MDIO-D
e1-MDIO-D/1.8: R62.1 U8.3(A1) U10.14(MDIO)  [project net e1-MDIO-D/1.8_5]
e1-RxCLK: R3.1 U1.Y7(IO-L13P-MRCC)  [project net e1-RxCLK_5]
e1-RxD0: U1.Y8(IO-L14N-SRCC) U10.25(RXD0)  [project net e1-RxD0_5]
e1-RxD1: U1.W8(IO-L15N) U10.24(RXD1)  [project net e1-RxD1_5]
e1-RxD2: U1.Y9(IO-L14P-SRCC) U10.23(RXD2)  [project net e1-RxD2_5]
e1-RxD3: U1.W9(IO-L16N) U10.22(RXD3)  [project net e1-RxD3_5]
e1-RxVAL: U1.V8(IO-L15P) U10.26(RX-VALID)  [project net e1-RxVAL_5]
e1-TxCLK: R1.2 U10.20(TX-CLK)  [project net e1-TxCLK_5]
e1-TxD0: U1.Y11(IO-L18N) U10.18(TXD0)  [project net e1-TxD0_5]
e1-TxD1: U1.W11(IO-L18P) U10.17(TXD1)  [project net e1-TxD1_5]
e1-TxD2: U1.Y12(IO-L20P) U10.16(TXD2)  [project net e1-TxD2_5]
e1-TxD3: U1.Y13(IO-L20N) U10.15(TXD3)  [project net e1-TxD3_5]
e1-TxEN: U1.W10(IO-L16P) U10.19(TX-EN)  [project net e1-TxEN_5]
e2-/IRQ: U11.31(~{INTR}) ; port e2-/IRQ
e2-/RESET: R59.1 U11.12(~{RESET}) ; port e2-/RESET
e2-CLK25: R39.2 U11.37(XO)  [project net e2-CLK25_5]
e2-LED1: J8.11B(A(G)) R71.2 U11.33(/LED1-100)  [project net e2-LED1_5]
e2-LED2: J8.14B(K(Y)) R70.2 U11.34(LED2-1000)  [project net e2-LED2_5]
e2-MDIO-C: U9.1 ; port e2-MDIO-C
e2-MDIO-C/1.8: U9.6 U11.13(MDC)  [project net e2-MDIO-C/1.8_5]
e2-MDIO-D/1.8: R63.1 U1.W6(IO-L22N) U11.14(MDIO)  [project net e2-MDIO-D/1.8_5]
e2-RxCLK: R4.1 U1.T9(IO-L12P-MRCC)  [project net e2-RxCLK_5]
e2-RxD0: U1.V5(IO-L6N-VREF) U11.25(RXD0)  [project net e2-RxD0_5]
e2-RxD1: U1.V6(IO-L22P) U11.24(RXD1)  [project net e2-RxD1_5]
e2-RxD2: U1.U5(IO-L19N-VREF) U11.23(RXD2)  [project net e2-RxD2_5]
e2-RxD3: U1.V7(IO-L11N-SRCC) U11.22(RXD3)  [project net e2-RxD3_5]
e2-RxVAL: U1.T5(IO-L19P) U11.26(RX-VALID)  [project net e2-RxVAL_5]
e2-TxCLK: R2.2 U11.20(TX-CLK)  [project net e2-TxCLK_5]
e2-TxD0: U1.U8(IO-L17N) U11.18(TXD0)  [project net e2-TxD0_5]
e2-TxD1: U1.U9(IO-L17P) U11.17(TXD1)  [project net e2-TxD1_5]
e2-TxD2: U1.V10(IO-L21N) U11.16(TXD2)  [project net e2-TxD2_5]
e2-TxD3: U1.U10(IO-L12N-MRCC) U11.15(TXD3)  [project net e2-TxD3_5]
e2-TxEN: U1.U7(IO-L11P-SRCC) U11.19(TX-EN)  [project net e2-TxEN_5]
e-CLK25: R38.1 R39.1 U19.3(OUT)  [project net e-CLK25_5]
ETH1-A+: J8.2A(1P) U10.1(Tx/Rx-A+)  [project net ETH1-A+_5]
ETH1-A-: J8.3A(1N) U10.2(Tx/Rx-A-)  [project net ETH1-A-_5]
ETH1-B+: J8.4A(2P) U10.4(Tx/Rx-B+)  [project net ETH1-B+_5]
ETH1-B-: J8.5A(2N) U10.5(Tx/Rx-B-)  [project net ETH1-B-_5]
ETH1-C+: J8.6A(3P) U10.6(Tx/Rx-C+)  [project net ETH1-C+_5]
ETH1-C-: J8.7A(3N) U10.7(Tx/Rx-C-)  [project net ETH1-C-_5]
ETH1-D+: J8.8A(4P) U10.9(Tx/Rx-D+)  [project net ETH1-D+_5]
ETH1-D-: J8.9A(4N) U10.10(Tx/Rx-D-)  [project net ETH1-D-_5]
ETH2-A+: J8.2B(1P) U11.1(Tx/Rx-A+)  [project net ETH2-A+_5]
ETH2-A-: J8.3B(1N) U11.2(Tx/Rx-A-)  [project net ETH2-A-_5]
ETH2-B+: J8.4B(2P) U11.4(Tx/Rx-B+)  [project net ETH2-B+_5]
ETH2-B-: J8.5B(2N) U11.5(Tx/Rx-B-)  [project net ETH2-B-_5]
ETH2-C+: J8.6B(3P) U11.6(Tx/Rx-C+)  [project net ETH2-C+_5]
ETH2-C-: J8.7B(3N) U11.7(Tx/Rx-C-)  [project net ETH2-C-_5]
ETH2-D+: J8.8B(4P) U11.9(Tx/Rx-D+)  [project net ETH2-D+_5]
ETH2-D-: J8.9B(4N) U11.10(Tx/Rx-D-)  [project net ETH2-D-_5]
NetJ8_12A: J8.12A(K(G)) R42.1
NetJ8_12B: J8.12B(K(G)) R40.1
NetJ8_13A: J8.13A(A(Y)) R43.2
NetJ8_13B: J8.13B(A(Y)) R41.2
NetR1_1: R1.1 U1.V11(IO-L21P)
NetR2_1: R2.1 U1.Y6(IO-L13N-MRCC)
NetR3_2: R3.2 U10.27(RX-CLK)
NetR4_2: R4.2 U11.27(RX-CLK)
NetR65_1: R65.1 U10.39(RBIAS)
NetR66_1: R66.1 U11.39(RBIAS)

Not connected (* = marked no-connect by the designer): J8 10A(NC) 10B(NC); U10 32(LED0-10) 35(CLKOUT)*; U11 32(LED0-10) 35(CLKOUT)*

### Layout directives
net class DIFF100: ETH1-A+_5, ETH1-A-_5, ETH1-B+_5, ETH1-B-_5, ETH1-C+_5, ETH1-C-_5, ETH1-D+_5, ETH1-D-_5, ETH2-A+_5, ETH2-A-_5, ETH2-B+_5, ETH2-B-_5, ETH2-C+_5, ETH2-C-_5, ETH2-D+_5, ETH2-D-_5

### Notes on the sheet
- PL Ethernet Ports
- e1-RxCLK & e2-RxCLK Must Be On MRCC I/O
- Pin
- Name
- Default
- Value
- Config.
- Description
- 22
- 27
- 26
- PHYAD0
- PHYAD1
- PHYAD2
- 1
- 0
- 001 => PHY Address 001
- 23
- 24
- 25
- PLLOFF
- TXDLY
- RXDLY
- RxC Delayed by 2ns
- PLL always on
- TxC Not Delayed
- [34]
- 32
- 33
- 34
- LOD0
- LDO1
- CFG-EXT
- 10 => 1.8V
- Internal LDO for I/O pins
- [33]
- 2
- 3
- 4
- 5
- A
- B
- C
- Drawing Title:
- D
- E
- Sheet:
- Rev:
- F
- Title:
- Part No:
- Print Date:
- File Name:
- Sheet
- of
- (in symbol RJ-45-2-TRANSFORMER-PULSE, part A) 6; 4; 5; 7; 8; Y; G
- (in symbol RJ-45-2-TRANSFORMER-PULSE, part B) 6; 4; 5; 7; 8; Y; G
- (in symbol XC7Z020-CLG400, part D) BANK 13

### Library data of the parts
CB70-CB73 = CAP-GND
J8 = RJ-45-2-TRANSFORMER-PULSE: PULSE JXD0-2015NL
R1-R4 R38 R39 R41 R43 R62 R63 R68-R71 = R
R40 R42 R58 R59 R65 R66 = R-GND
U9 = 2G17-1: NC7WZ17
U10 U11 = RTL8211F: Ethernet PHY
U19 = OSCILATOR

## Sheet S06.SchDoc: IEEE-1394/Ethernet FPGA Controller
size 381 x 254 mm; Revision: 3.2; SheetNumber: 6; SheetTotal: 10
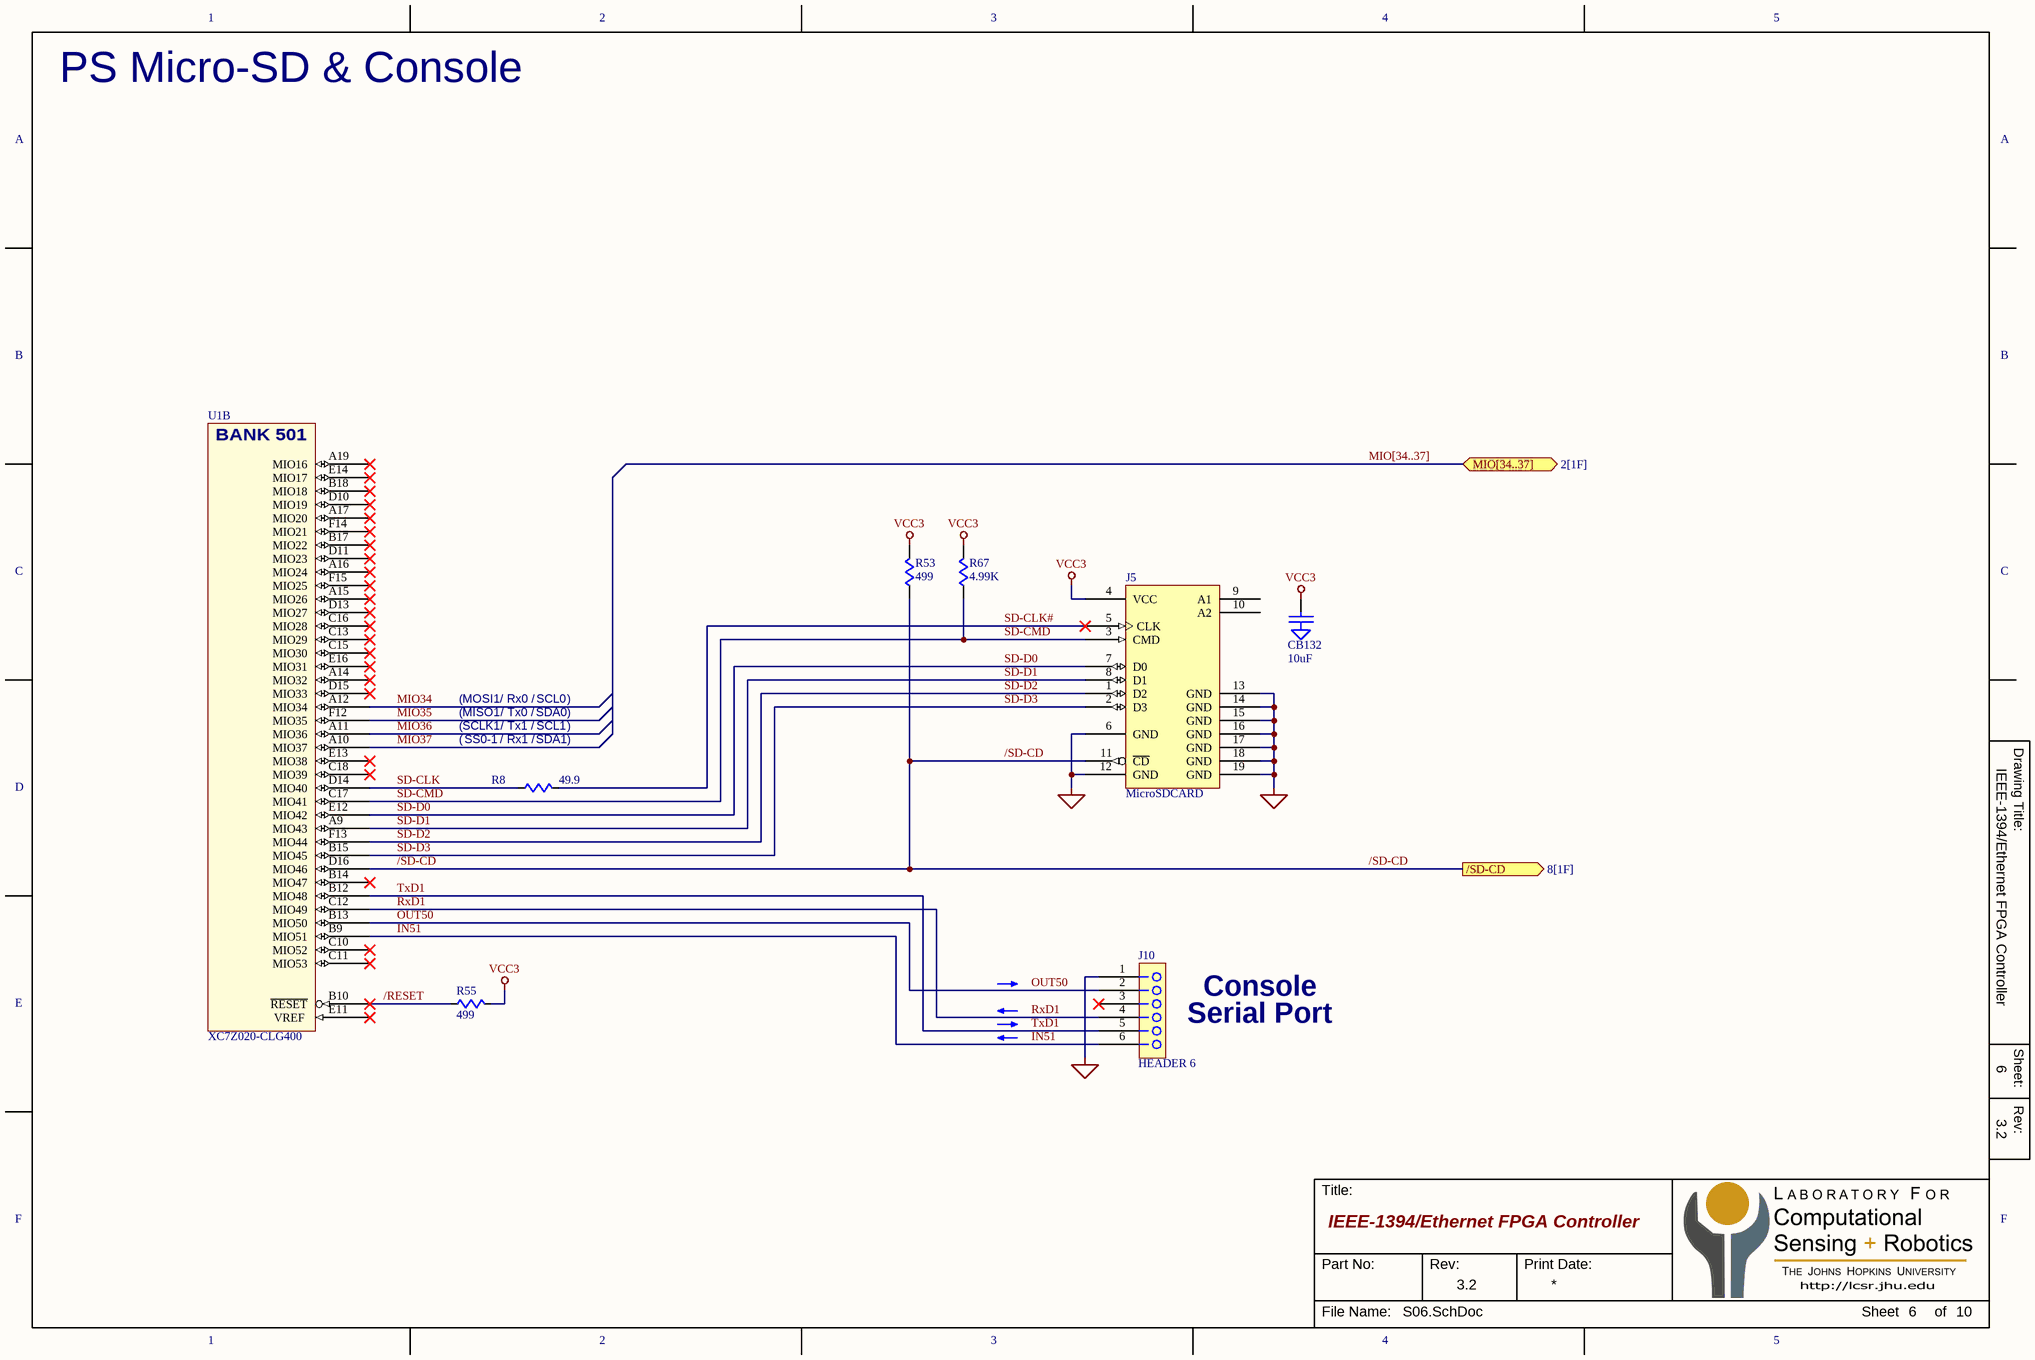
[diagram p5: S06.SchDoc]

### Parts
CB132  10uF  [CB0603]
J5  MicroSDCARD  [CONN-uSD-JAE-ST12S0]
J10  HEADER 6  [HDR-6x1-100]
R8  49.9  [R0201]
R53  499  [R0402]
R55  499  [R0402]
R67  4.99K  [R0402]
U1  XC7Z020-CLG400  [BGA-400-08mm]  (part B of 9)

### Ports
/SD-CD (out, see 8[1F]), MIO[34..37] (bidir, see 2[1F])

### Nets
GND: CB132.2(GND) J5.6(GND) J5.12(GND) J5.13(GND) J5.14(GND) J5.15(GND) J5.16(GND) J5.17(GND) J5.18(GND) J5.19(GND) J10.1
VCC3: CB132.1 J5.4(VCC) R53.2 R55.2 R67.2
/RESET: R55.1 U1.B10(~{RESET})  [project net /RESET_6]
/SD-CD: J5.11(~{CD}) R53.1 U1.D16(MIO46) ; port /SD-CD
IN51: J10.6 U1.B9(MIO51)  [project net IN51_6]
MIO34: U1.A12(MIO34)
MIO35: U1.F12(MIO35)
MIO36: U1.A11(MIO36)
MIO37: U1.A10(MIO37)
OUT50: J10.2 U1.B13(MIO50)  [project net OUT50_6]
RxD1: J10.4 U1.C12(MIO49)  [project net RxD1_6]
SD-CLK: R8.1 U1.D14(MIO40)  [project net SD-CLK_6]
SD-CLK#: J5.5(CLK) R8.2  [project net SD-CLK#_6]
SD-CMD: J5.3(CMD) R67.1 U1.C17(MIO41)  [project net SD-CMD_6]
SD-D0: J5.7(D0) U1.E12(MIO42)  [project net SD-D0_6]
SD-D1: J5.8(D1) U1.A9(MIO43)  [project net SD-D1_6]
SD-D2: J5.1(D2) U1.F13(MIO44)  [project net SD-D2_6]
SD-D3: J5.2(D3) U1.B15(MIO45)  [project net SD-D3_6]
TxD1: J10.5 U1.B12(MIO48)  [project net TxD1_6]

Not connected (* = marked no-connect by the designer): J5 9(A1) 10(A2); J10 3*; U1 A14(MIO32)* A15(MIO26)* A16(MIO24)* A17(MIO20)* A19(MIO16)* B14(MIO47)* B17(MIO22)* B18(MIO18)* C10(MIO52)* C11(MIO53)* C13(MIO29)* C15(MIO30)* C16(MIO28)* C18(MIO39)* D10(MIO19)* D11(MIO23)* D13(MIO27)* D15(MIO33)* E11(VREF_)* E13(MIO38)* E14(MIO17)* E16(MIO31)* F14(MIO21)* F15(MIO25)*

### Buses and harness runs
bus MIO[34..37] = port MIO[34..37]

### Notes on the sheet
- PS Micro-SD & Console
- (
- MOSI1
- / Rx0 /
- SCL0
- )
- MISO1
- SCLK1
- (near R8) SS0-1
- / Tx0 /
- / Tx1 /
- (near R8) / Rx1 /
- SDA0
- SCL1
- (near R8) SDA1
- (near R8) )
- Console
- (near J10) Serial Port
- 1
- 2
- 3
- 4
- 5
- A
- B
- C
- Drawing Title:
- D
- E
- Sheet:
- Rev:
- F
- Title:
- Part No:
- Print Date:
- File Name:
- Sheet
- of
- (in symbol XC7Z020-CLG400, part B) BANK 501

### Library data of the parts
CB132 = CAP-GND
J5 = CONN-MICROSD-ST12S0
R8 R53 R55 R67 = R

## Sheet S07.SchDoc: IEEE-1394/Ethernet FPGA Controller
size 381 x 254 mm; Revision: 3.2; SheetNumber: 7; SheetTotal: 10
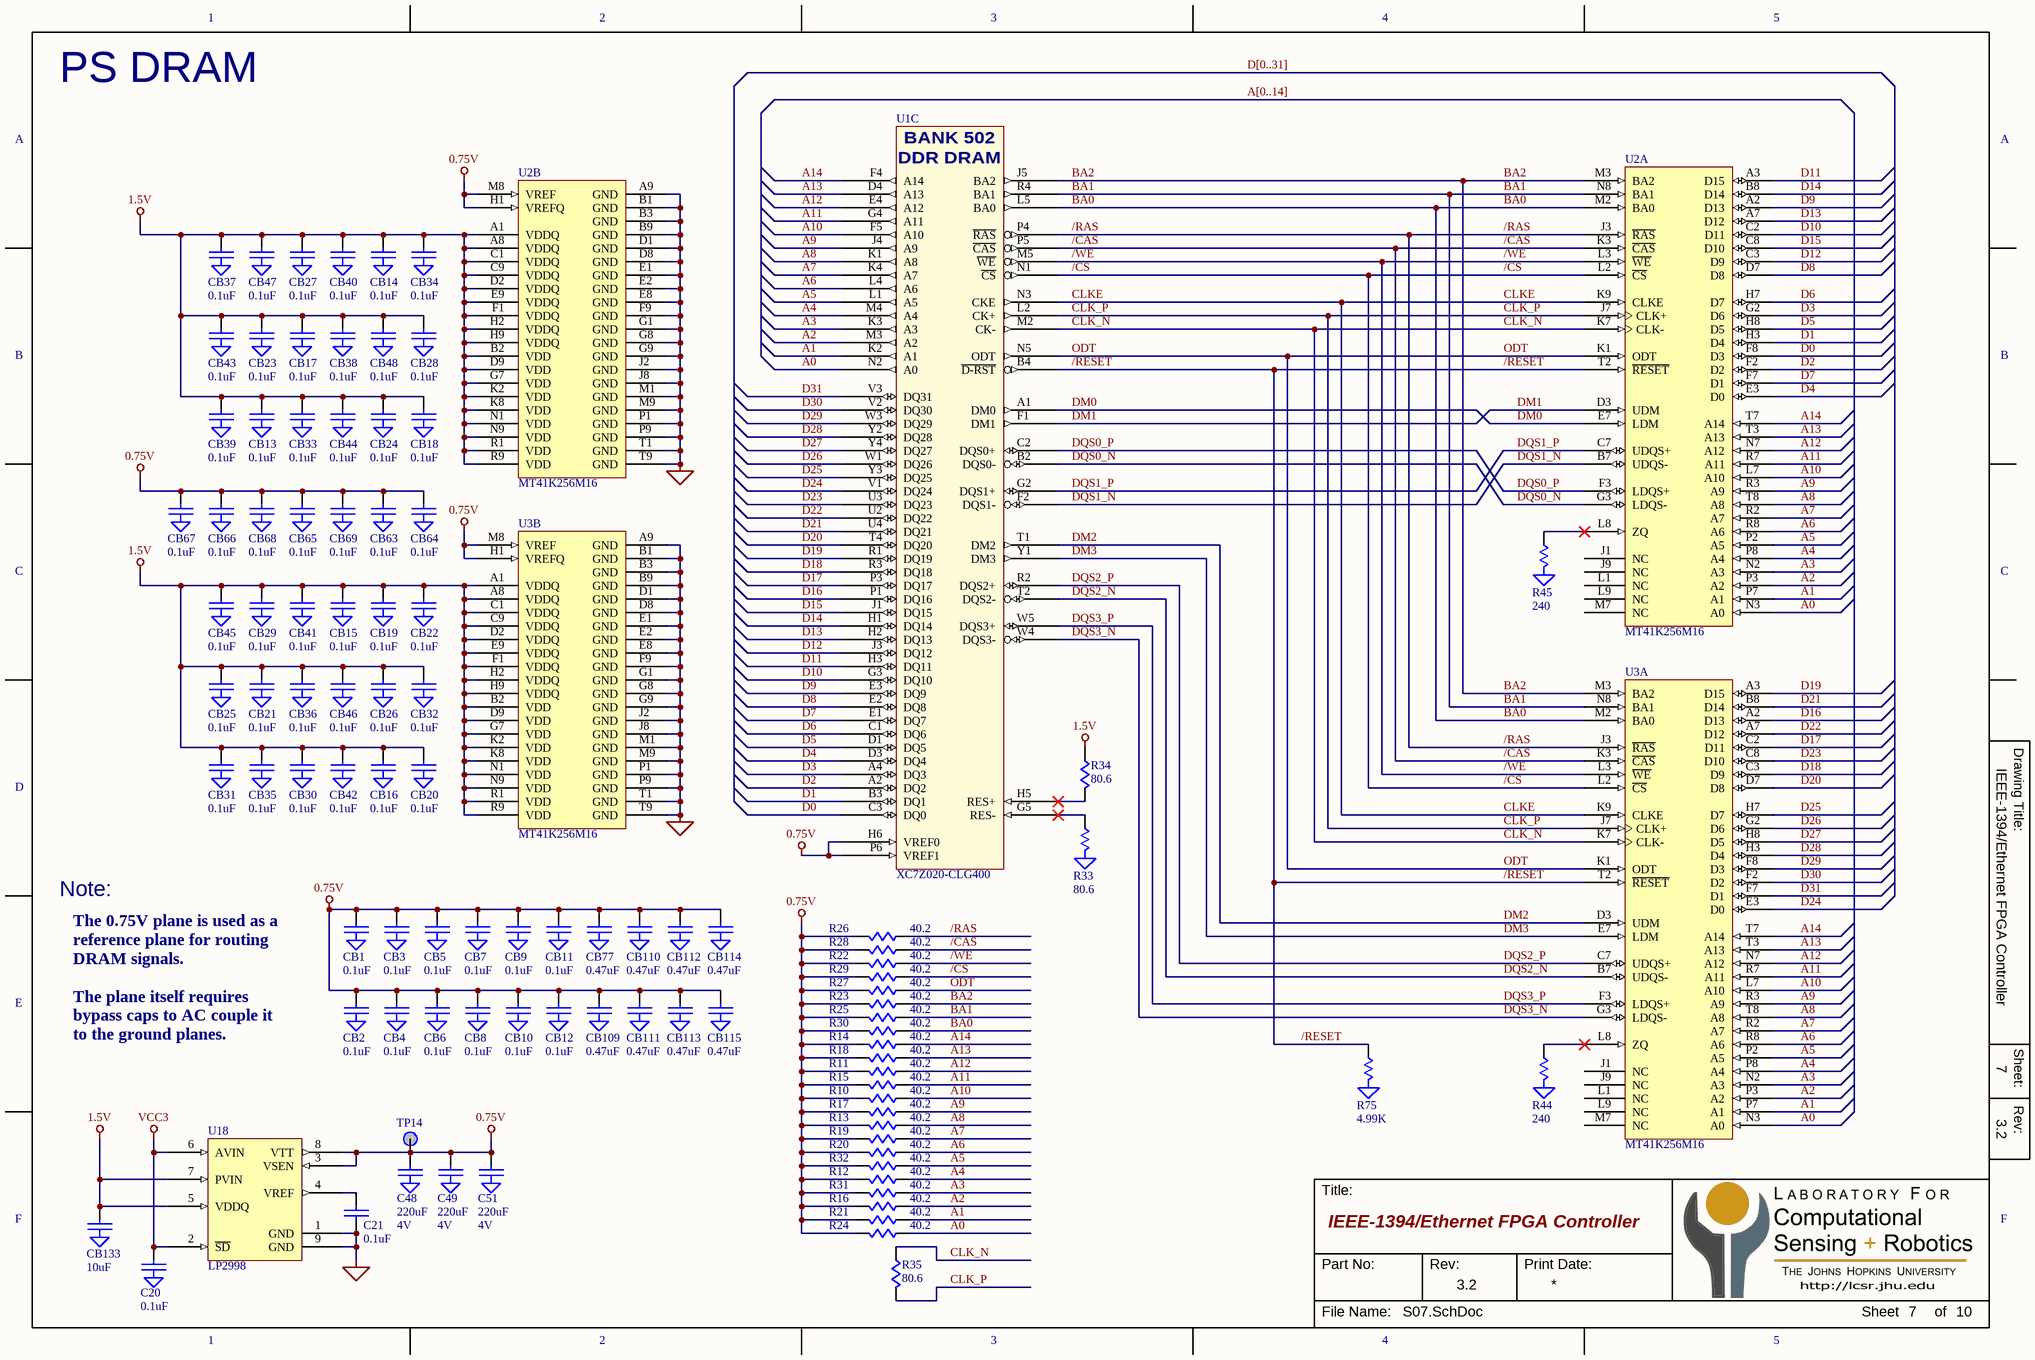
[diagram p6: S07.SchDoc]

### Parts
C20  0.1uF  [C0402]
C21  0.1uF  [C0402]
C48  220uF  [C1206]
C49  220uF  [C1206]
C51  220uF  [C1206]
CB1  0.1uF  [C0201]
CB2  0.1uF  [C0201]
CB3  0.1uF  [C0201]
CB4  0.1uF  [C0201]
CB5  0.1uF  [C0201]
CB6  0.1uF  [C0201]
CB7  0.1uF  [C0201]
CB8  0.1uF  [C0201]
CB9  0.1uF  [C0201]
CB10  0.1uF  [C0201]
CB11  0.1uF  [C0201]
CB12  0.1uF  [C0201]
CB13  0.1uF  [C0201]
CB14  0.1uF  [C0201]
CB15  0.1uF  [C0201]
CB16  0.1uF  [C0201]
CB17  0.1uF  [C0201]
CB18  0.1uF  [C0201]
CB19  0.1uF  [C0201]
CB20  0.1uF  [C0201]
CB21  0.1uF  [C0201]
CB22  0.1uF  [C0201]
CB23  0.1uF  [C0201]
CB24  0.1uF  [C0201]
CB25  0.1uF  [C0201]
CB26  0.1uF  [C0201]
CB27  0.1uF  [C0201]
CB28  0.1uF  [C0201]
CB29  0.1uF  [C0201]
CB30  0.1uF  [C0201]
CB31  0.1uF  [C0201]
CB32  0.1uF  [C0201]
CB33  0.1uF  [C0201]
CB34  0.1uF  [C0201]
CB35  0.1uF  [C0201]
CB36  0.1uF  [C0201]
CB37  0.1uF  [C0201]
CB38  0.1uF  [C0201]
CB39  0.1uF  [C0201]
CB40  0.1uF  [C0201]
CB41  0.1uF  [C0201]
CB42  0.1uF  [C0201]
CB43  0.1uF  [C0201]
CB44  0.1uF  [C0201]
CB45  0.1uF  [C0201]
CB46  0.1uF  [C0201]
CB47  0.1uF  [C0201]
CB48  0.1uF  [C0201]
CB63  0.1uF  [C0201]
CB64  0.1uF  [C0201]
CB65  0.1uF  [C0201]
CB66  0.1uF  [C0201]
CB67  0.1uF  [C0201]
CB68  0.1uF  [C0201]
CB69  0.1uF  [C0201]
CB77  0.47uF  [CB0402]
CB109  0.47uF  [CB0402]
CB110  0.47uF  [CB0402]
CB111  0.47uF  [CB0402]
CB112  0.47uF  [CB0402]
CB113  0.47uF  [CB0402]
CB114  0.47uF  [CB0402]
CB115  0.47uF  [CB0402]
CB133  10uF  [CB0603]
R10  40.2  [R0402]
R11  40.2  [R0402]
R12  40.2  [R0402]
R13  40.2  [R0402]
R14  40.2  [R0402]
R15  40.2  [R0402]
R16  40.2  [R0402]
R17  40.2  [R0402]
R18  40.2  [R0402]
R19  40.2  [R0402]
R20  40.2  [R0402]
R21  40.2  [R0402]
R22  40.2  [R0402]
R23  40.2  [R0402]
R24  40.2  [R0402]
R25  40.2  [R0402]
R26  40.2  [R0402]
R27  40.2  [R0402]
R28  40.2  [R0402]
R29  40.2  [R0402]
R30  40.2  [R0402]
R31  40.2  [R0402]
R32  40.2  [R0402]
R33  80.6  [R0402]
R34  80.6  [R0402]
R35  80.6  [R0402]
R44  240  [R0402]
R45  240  [R0402]
R75  4.99K  [R0402]
TP14  PAD  [PAD25-SM]  (value not drawn)  (no BOM)
U1  XC7Z020-CLG400  [BGA-400-08mm]  (part C of 9)
U2  MT41K256M16  [BGA-96-14x8mm]  (parts A,B of 2)
U3  MT41K256M16  [BGA-96-14x8mm]  (parts A,B of 2)
U18  LP2998  [SO-9]

### Nets
0.75V: C48.1 C49.1 C51.1 CB1.1 CB2.1 CB3.1 CB4.1 CB5.1 CB6.1 CB7.1 CB8.1 CB9.1 CB10.1 CB11.1 CB12.1 CB63.1 CB64.1 CB65.1 CB66.1 CB67.1 CB68.1 CB69.1 CB77.1 CB109.1 CB110.1 CB111.1 CB112.1 CB113.1 CB114.1 CB115.1 R10.2 R11.2 R12.2 R13.2 R14.2 R15.2 R16.2 R17.2 R18.2 R19.2 R20.2 R21.2 R22.2 R23.2 R24.2 R25.2 R26.2 R27.2 R28.2 R29.2 R30.2 R31.2 R32.2 TP14.1 U1.H6(VREF0) U1.P6(VREF1) U2.H1(VREFQ) U2.M8(VREF) U3.H1(VREFQ) U3.M8(VREF) U18.3(VSEN) U18.8(VTT)
1.5V: CB13.1 CB14.1 CB15.1 CB16.1 CB17.1 CB18.1 CB19.1 CB20.1 CB21.1 CB22.1 CB23.1 CB24.1 CB25.1 CB26.1 CB27.1 CB28.1 CB29.1 CB30.1 CB31.1 CB32.1 CB33.1 CB34.1 CB35.1 CB36.1 CB37.1 CB38.1 CB39.1 CB40.1 CB41.1 CB42.1 CB43.1 CB44.1 CB45.1 CB46.1 CB47.1 CB48.1 CB133.1 R34.1 U2.A1(VDDQ) U2.A8(VDDQ) U2.B2(VDD) U2.C1(VDDQ) U2.C9(VDDQ) U2.D2(VDDQ) U2.D9(VDD) U2.E9(VDDQ) U2.F1(VDDQ) U2.G7(VDD) U2.H2(VDDQ) U2.H9(VDDQ) U2.K2(VDD) U2.K8(VDD) U2.N1(VDD) U2.N9(VDD) U2.R1(VDD) U2.R9(VDD) U3.A1(VDDQ) U3.A8(VDDQ) U3.B2(VDD) U3.C1(VDDQ) U3.C9(VDDQ) U3.D2(VDDQ) U3.D9(VDD) U3.E9(VDDQ) U3.F1(VDDQ) U3.G7(VDD) U3.H2(VDDQ) U3.H9(VDDQ) U3.K2(VDD) U3.K8(VDD) U3.N1(VDD) U3.N9(VDD) U3.R1(VDD) U3.R9(VDD) U18.5(VDDQ) U18.7(PVIN)
GND: C20.2(GND) C21.2 C48.2(GND) C49.2(GND) C51.2(GND) CB1.2(GND) CB2.2(GND) CB3.2(GND) CB4.2(GND) CB5.2(GND) CB6.2(GND) CB7.2(GND) CB8.2(GND) CB9.2(GND) CB10.2(GND) CB11.2(GND) CB12.2(GND) CB13.2(GND) CB14.2(GND) CB15.2(GND) CB16.2(GND) CB17.2(GND) CB18.2(GND) CB19.2(GND) CB20.2(GND) CB21.2(GND) CB22.2(GND) CB23.2(GND) CB24.2(GND) CB25.2(GND) CB26.2(GND) CB27.2(GND) CB28.2(GND) CB29.2(GND) CB30.2(GND) CB31.2(GND) CB32.2(GND) CB33.2(GND) CB34.2(GND) CB35.2(GND) CB36.2(GND) CB37.2(GND) CB38.2(GND) CB39.2(GND) CB40.2(GND) CB41.2(GND) CB42.2(GND) CB43.2(GND) CB44.2(GND) CB45.2(GND) CB46.2(GND) CB47.2(GND) CB48.2(GND) CB63.2(GND) CB64.2(GND) CB65.2(GND) CB66.2(GND) CB67.2(GND) CB68.2(GND) CB69.2(GND) CB77.2(GND) CB109.2(GND) CB110.2(GND) CB111.2(GND) CB112.2(GND) CB113.2(GND) CB114.2(GND) CB115.2(GND) CB133.2(GND) R33.2(GND) R44.2(GND) R45.2(GND) R75.2(GND) U2.A9(GND) U2.B1(GND) U2.B3(GND) U2.B9(GND) U2.D1(GND) U2.D8(GND) U2.E1(GND) U2.E2(GND) U2.E8(GND) U2.F9(GND) U2.G1(GND) U2.G8(GND) U2.G9(GND) U2.J2(GND) U2.J8(GND) U2.M1(GND) U2.M9(GND) U2.P1(GND) U2.P9(GND) U2.T1(GND) U2.T9(GND) U3.A9(GND) U3.B1(GND) U3.B3(GND) U3.B9(GND) U3.D1(GND) U3.D8(GND) U3.E1(GND) U3.E2(GND) U3.E8(GND) U3.F9(GND) U3.G1(GND) U3.G8(GND) U3.G9(GND) U3.J2(GND) U3.J8(GND) U3.M1(GND) U3.M9(GND) U3.P1(GND) U3.P9(GND) U3.T1(GND) U3.T9(GND) U18.1(GND) U18.9(GND)
VCC3: C20.1 U18.2(~{SD}) U18.6(AVIN)
/CAS: R28.1 U1.P5(~{CAS}) U2.K3(~{CAS}) U3.K3(~{CAS})  [project net /CAS_7]
/CS: R29.1 U1.N1(~{CS}) U2.L2(~{CS}) U3.L2(~{CS})  [project net /CS_7]
/RAS: R26.1 U1.P4(~{RAS}) U2.J3(~{RAS}) U3.J3(~{RAS})  [project net /RAS_7]
/RESET: R75.1 U1.B4(~{D-RST}) U2.T2(~{RESET}) U3.T2(~{RESET})  [project net /RESET_7]
/WE: R22.1 U1.M5(~{WE}) U2.L3(~{WE}) U3.L3(~{WE})  [project net /WE_7]
A0: R24.1 U1.N2(A0) U2.N3(A0) U3.N3(A0)  [project net A0_7]
A1: R21.1 U1.K2(A1) U2.P7(A1) U3.P7(A1)  [project net A1_7]
A2: R16.1 U1.M3(A2) U2.P3(A2) U3.P3(A2)  [project net A2_7]
A3: R31.1 U1.K3(A3) U2.N2(A3) U3.N2(A3)  [project net A3_7]
A4: R12.1 U1.M4(A4) U2.P8(A4) U3.P8(A4)  [project net A4_7]
A5: R32.1 U1.L1(A5) U2.P2(A5) U3.P2(A5)  [project net A5_7]
A6: R20.1 U1.L4(A6) U2.R8(A6) U3.R8(A6)  [project net A6_7]
A7: R19.1 U1.K4(A7) U2.R2(A7) U3.R2(A7)  [project net A7_7]
A8: R13.1 U1.K1(A8) U2.T8(A8) U3.T8(A8)  [project net A8_7]
A9: R17.1 U1.J4(A9) U2.R3(A9) U3.R3(A9)  [project net A9_7]
A10: R10.1 U1.F5(A10) U2.L7(A10) U3.L7(A10)  [project net A10_7]
A11: R15.1 U1.G4(A11) U2.R7(A11) U3.R7(A11)  [project net A11_7]
A12: R11.1 U1.E4(A12) U2.N7(A12) U3.N7(A12)  [project net A12_7]
A13: R18.1 U1.D4(A13) U2.T3(A13) U3.T3(A13)  [project net A13_7]
A14: R14.1 U1.F4(A14) U2.T7(A14) U3.T7(A14)  [project net A14_7]
BA0: R30.1 U1.L5(BA0) U2.M2(BA0) U3.M2(BA0)  [project net BA0_7]
BA1: R25.1 U1.R4(BA1) U2.N8(BA1) U3.N8(BA1)  [project net BA1_7]
BA2: R23.1 U1.J5(BA2) U2.M3(BA2) U3.M3(BA2)  [project net BA2_7]
CLK_N: R35.1 U1.M2(CK-) U2.K7(CLK-) U3.K7(CLK-)  [project net CLK_N_7]
CLK_P: R35.2 U1.L2(CK+) U2.J7(CLK+) U3.J7(CLK+)  [project net CLK_P_7]
CLKE: U1.N3(CKE) U2.K9(CLKE) U3.K9(CLKE)  [project net CLKE_7]
D0: U1.C3(DQ0) U2.F8(D3)  [project net D0_7]
D1: U1.B3(DQ1) U2.H3(D4)  [project net D1_7]
D2: U1.A2(DQ2) U2.F2(D2)  [project net D2_7]
D3: U1.A4(DQ3) U2.G2(D6)  [project net D3_7]
D4: U1.D3(DQ4) U2.E3(D0)  [project net D4_7]
D5: U1.D1(DQ5) U2.H8(D5)  [project net D5_7]
D6: U1.C1(DQ6) U2.H7(D7)  [project net D6_7]
D7: U1.E1(DQ7) U2.F7(D1)  [project net D7_7]
D8: U1.E2(DQ8) U2.D7(D8)  [project net D8_7]
D9: U1.E3(DQ9) U2.A2(D13)  [project net D9_7]
D10: U1.G3(DQ10) U2.C2(D11)  [project net D10_7]
D11: U1.H3(DQ11) U2.A3(D15)  [project net D11_7]
D12: U1.J3(DQ12) U2.C3(D9)  [project net D12_7]
D13: U1.H2(DQ13) U2.A7(D12)  [project net D13_7]
D14: U1.H1(DQ14) U2.B8(D14)  [project net D14_7]
D15: U1.J1(DQ15) U2.C8(D10)  [project net D15_7]
D16: U1.P1(DQ16) U3.A2(D13)  [project net D16_7]
D17: U1.P3(DQ17) U3.C2(D11)  [project net D17_7]
D18: U1.R3(DQ18) U3.C3(D9)  [project net D18_7]
D19: U1.R1(DQ19) U3.A3(D15)  [project net D19_7]
D20: U1.T4(DQ20) U3.D7(D8)  [project net D20_7]
D21: U1.U4(DQ21) U3.B8(D14)  [project net D21_7]
D22: U1.U2(DQ22) U3.A7(D12)  [project net D22_7]
D23: U1.U3(DQ23) U3.C8(D10)  [project net D23_7]
D24: U1.V1(DQ24) U3.E3(D0)  [project net D24_7]
D25: U1.Y3(DQ25) U3.H7(D7)  [project net D25_7]
D26: U1.W1(DQ26) U3.G2(D6)  [project net D26_7]
D27: U1.Y4(DQ27) U3.H8(D5)  [project net D27_7]
D28: U1.Y2(DQ28) U3.H3(D4)  [project net D28_7]
D29: U1.W3(DQ29) U3.F8(D3)  [project net D29_7]
D30: U1.V2(DQ30) U3.F2(D2)  [project net D30_7]
D31: U1.V3(DQ31) U3.F7(D1)  [project net D31_7]
DM0: U1.A1(DM0) U2.E7(LDM)  [project net DM0_7]
DM1: U1.F1(DM1) U2.D3(UDM)  [project net DM1_7]
DM2: U1.T1(DM2) U3.D3(UDM)  [project net DM2_7]
DM3: U1.Y1(DM3) U3.E7(LDM)  [project net DM3_7]
DQS0_N: U1.B2(DQS0-) U2.G3(LDQS-)  [project net DQS0_N_7]
DQS0_P: U1.C2(DQS0+) U2.F3(LDQS+)  [project net DQS0_P_7]
DQS1_N: U1.F2(DQS1-) U2.B7(UDQS-)  [project net DQS1_N_7]
DQS1_P: U1.G2(DQS1+) U2.C7(UDQS+)  [project net DQS1_P_7]
DQS2_N: U1.T2(DQS2-) U3.B7(UDQS-)  [project net DQS2_N_7]
DQS2_P: U1.R2(DQS2+) U3.C7(UDQS+)  [project net DQS2_P_7]
DQS3_N: U1.W4(DQS3-) U3.G3(LDQS-)  [project net DQS3_N_7]
DQS3_P: U1.W5(DQS3+) U3.F3(LDQS+)  [project net DQS3_P_7]
ODT: R27.1 U1.N5(ODT) U2.K1(ODT) U3.K1(ODT)  [project net ODT_7]
NetC21_1: C21.1 U18.4(VREF)
NetR33_1: R33.1 U1.G5(RES-)
NetR34_2: R34.2 U1.H5(RES+)
NetR44_1: R44.1 U3.L8(ZQ)
NetR45_1: R45.1 U2.L8(ZQ)

Not connected (* = marked no-connect by the designer): U2 J1(NC) J9(NC) L1(NC) L9(NC) M7(NC); U3 J1(NC) J9(NC) L1(NC) L9(NC) M7(NC)

### Buses and harness runs
bus A[0..14]
bus D[0..31]

### Notes on the sheet
- PS DRAM
- Note:
- The 0.75V plane is used as a reference plane for routing DRAM signals.
  The plane itself requires bypass caps to AC couple it to the ground planes.
- 1
- 2
- 3
- 4
- 5
- A
- B
- C
- Drawing Title:
- D
- E
- Sheet:
- Rev:
- F
- Title:
- Part No:
- Print Date:
- File Name:
- Sheet
- of
- (in symbol CAP-GND) 4V
- (in symbol XC7Z020-CLG400, part C) BANK 502; DDR DRAM

### Library data of the parts
C20 C48 C49 C51 CB1-CB48 CB63-CB69 CB77 CB109-CB115 CB133 = CAP-GND
C21 = CAP
R10-R32 R34 R35 = R
R33 R44 R45 R75 = R-GND

## Sheet S08.SchDoc: IEEE-1394/Ethernet FPGA Controller
size 381 x 254 mm; Revision: 3.2; SheetNumber: 8; SheetTotal: 10
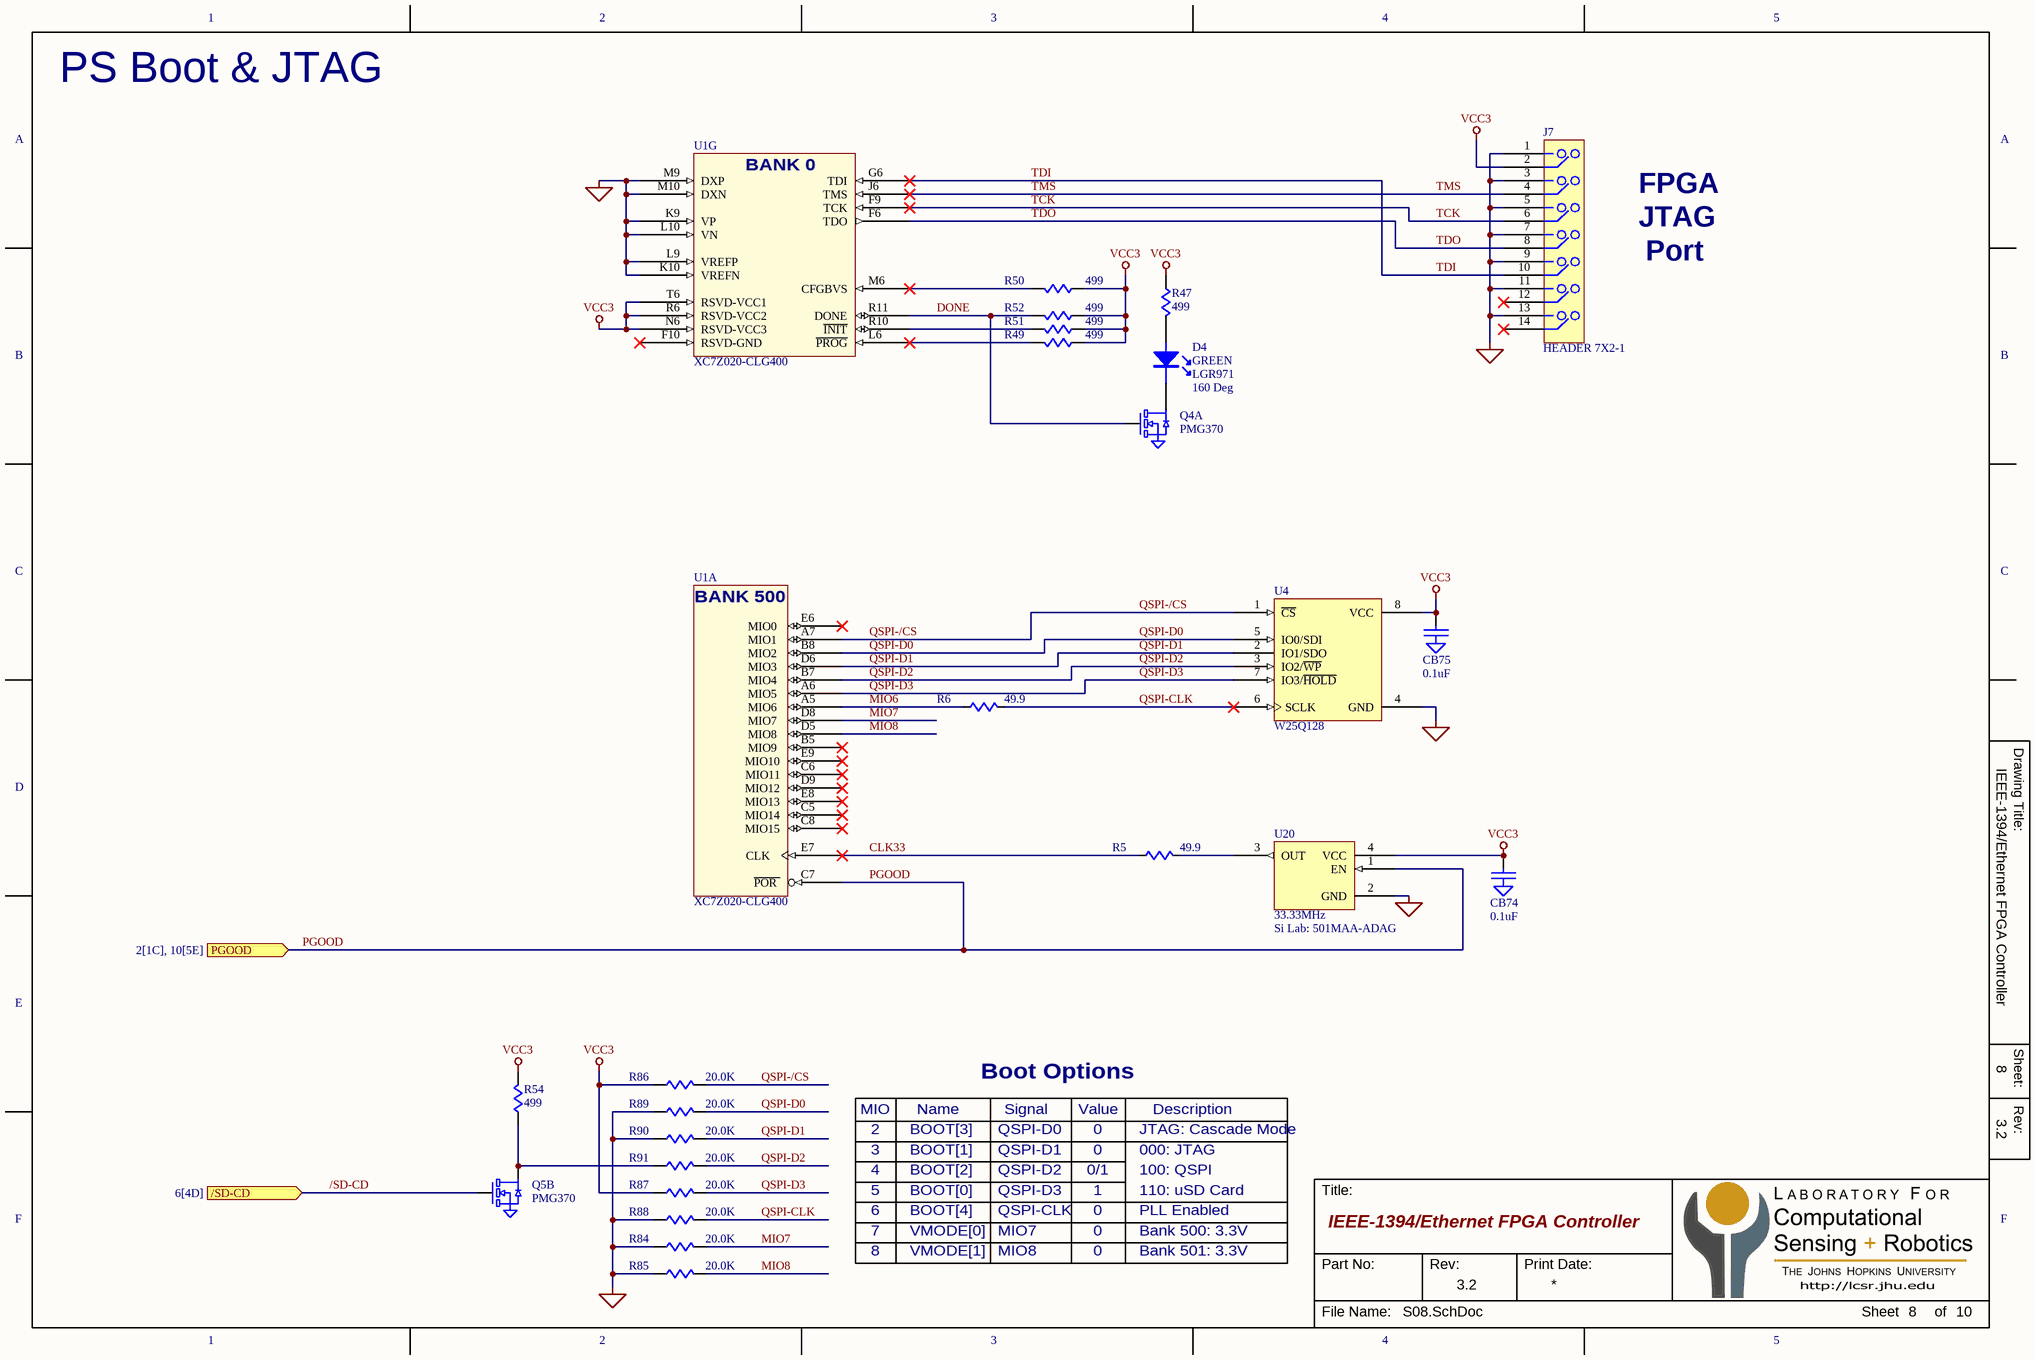
[diagram p7: S08.SchDoc]

### Parts
CB74  0.1uF  [C0201]
CB75  0.1uF  [C0201]
D4  Color: GREEN  P/N: LGR971  Angle: 160 Deg  [LED-0805]  (hidden comment: LED)
J7  HEADER 7X2-1  [HDR-7x2-2MM]
Q4  PMG370  [SC70-6-NP]  (part A of 2)
Q5  PMG370  [SC70-6-NP]  (part B of 2)
R5  49.9  [R0201]
R6  49.9  [R0201]
R47  499  [R0402]
R49  499  [R0402]
R50  499  [R0402]
R51  499  [R0402]
R52  499  [R0402]
R54  499  [R0402]
R84  20.0K  [R0402]
R85  20.0K  [R0402]
R86  20.0K  [R0402]
R87  20.0K  [R0402]
R88  20.0K  [R0402]
R89  20.0K  [R0402]
R90  20.0K  [R0402]
R91  20.0K  [R0402]
U1  XC7Z020-CLG400  [BGA-400-08mm]  (parts A,G of 9)
U4  W25Q128  [SOL-8]
U20  33.33MHz  [OSC-2x2.5mm]

### Ports
/SD-CD (in, see 6[4D]), PGOOD (in, see 2[1C], 10[5E])

### Nets
GND: CB74.2(GND) CB75.2(GND) J7.1 J7.3 J7.5 J7.7 J7.9 J7.11 J7.13 Q4.1(S1) Q5.4(S2) R84.1 R85.1 R88.1 R89.1 R90.1 U1.K9(VP) U1.K10(VREFN) U1.L9(VREFP) U1.L10(VN) U1.M9(DXP) U1.M10(DXN) U4.4(GND) U20.2(GND)
VCC3: CB74.1 CB75.1 J7.2 R47.1 R49.1 R50.1 R51.1 R52.1 R54.2 R86.1 R87.1 U1.N6(RSVD-VCC3) U1.R6(RSVD-VCC2) U1.T6(RSVD-VCC1) U4.8(VCC) U20.4(VCC)
/SD-CD: Q5.5(G2) ; port /SD-CD
CLK33: R5.1 U1.E7(CLK)  [project net CLK33_8]
DONE: Q4.2(G1) R52.2 U1.R11(DONE)  [project net DONE_8]
MIO6: R6.1 U1.A5(MIO6)  [project net MIO6_8]
MIO7: R84.2 U1.D8(MIO7)  [project net MIO7_8]
MIO8: R85.2 U1.D5(MIO8)  [project net MIO8_8]
PGOOD: U1.C7(~{POR_}) U20.1(EN) ; port PGOOD
QSPI-/CS: R86.2 U1.A7(MIO1) U4.1(~{CS})  [project net QSPI-/CS_8]
QSPI-CLK: R6.2 R88.2 U4.6(SCLK)  [project net QSPI-CLK_8]
QSPI-D0: R89.2 U1.B8(MIO2) U4.5(IO0/SDI)  [project net QSPI-D0_8]
QSPI-D1: R90.2 U1.D6(MIO3) U4.2(IO1/SDO)  [project net QSPI-D1_8]
QSPI-D2: R91.2 U1.B7(MIO4) U4.3(IO2/~{WP})  [project net QSPI-D2_8]
QSPI-D3: R87.2 U1.A6(MIO5) U4.7(IO3/~{HOLD})  [project net QSPI-D3_8]
TCK: J7.6 U1.F9(TCK)  [project net TCK_8]
TDI: J7.10 U1.G6(TDI)  [project net TDI_8]
TDO: J7.8 U1.F6(TDO)  [project net TDO_8]
TMS: J7.4 U1.J6(TMS)  [project net TMS_8]
NetD4_1: D4.1(C) Q4.6(D1)
NetD4_2: D4.2(A) R47.2
NetQ5_3: Q5.3(D2) R54.1 R91.1
NetR5_2: R5.2 U20.3(OUT)
NetR49_2: R49.2 U1.L6(~{PROG})
NetR50_2: R50.2 U1.M6(CFGBVS)
NetR51_2: R51.2 U1.R10(~{INIT})

Not connected (* = marked no-connect by the designer): J7 12* 14*; U1 B5(MIO9_)* C5(MIO14)* C6(MIO11)* C8(MIO15)* D9(MIO12)* E6(MIO0_)* E8(MIO13)* E9(MIO10)* F10(RSVD-GND)*

### Notes on the sheet
- PS Boot & JTAG
- FPGA
- JTAG
- Port
- MIO
- Name
- Signal
- Boot Options
- Value
- Description
- 2
- 3
- 4
- BOOT[3]
- BOOT[1]
- BOOT[2]
- QSPI-D0
- QSPI-D1
- QSPI-D2
- 0
- 0/1
- 100: QSPI
- JTAG: Cascade Mode
- 000: JTAG
- 5
- 6
- 7
- BOOT[0]
- BOOT[4]
- VMODE[0]
- QSPI-D3
- QSPI-CLK
- MIO7
- 1
- Bank 500: 3.3V
- 110: uSD Card
- PLL Enabled
- 8
- VMODE[1]
- MIO8
- Bank 501: 3.3V
- A
- B
- C
- Drawing Title:
- D
- E
- Sheet:
- Rev:
- F
- Title:
- Part No:
- Print Date:
- File Name:
- Sheet
- of
- (in symbol OSCILATOR) Si Lab: 501MAA-ADAG
- (in symbol XC7Z020-CLG400, part A) BANK 500
- (in symbol XC7Z020-CLG400, part G) BANK 0

### Library data of the parts
CB74 CB75 = CAP-GND
Q4 Q5 = MOSFET-N-DUAL6
R5 R6 R47 R49-R52 R54 R84-R91 = R
U20 = OSCILATOR

## Sheet S09.SchDoc: IEEE-1394/Ethernet FPGA Controller
size 381 x 254 mm; Revision: 3.2; SheetNumber: 9; SheetTotal: 10
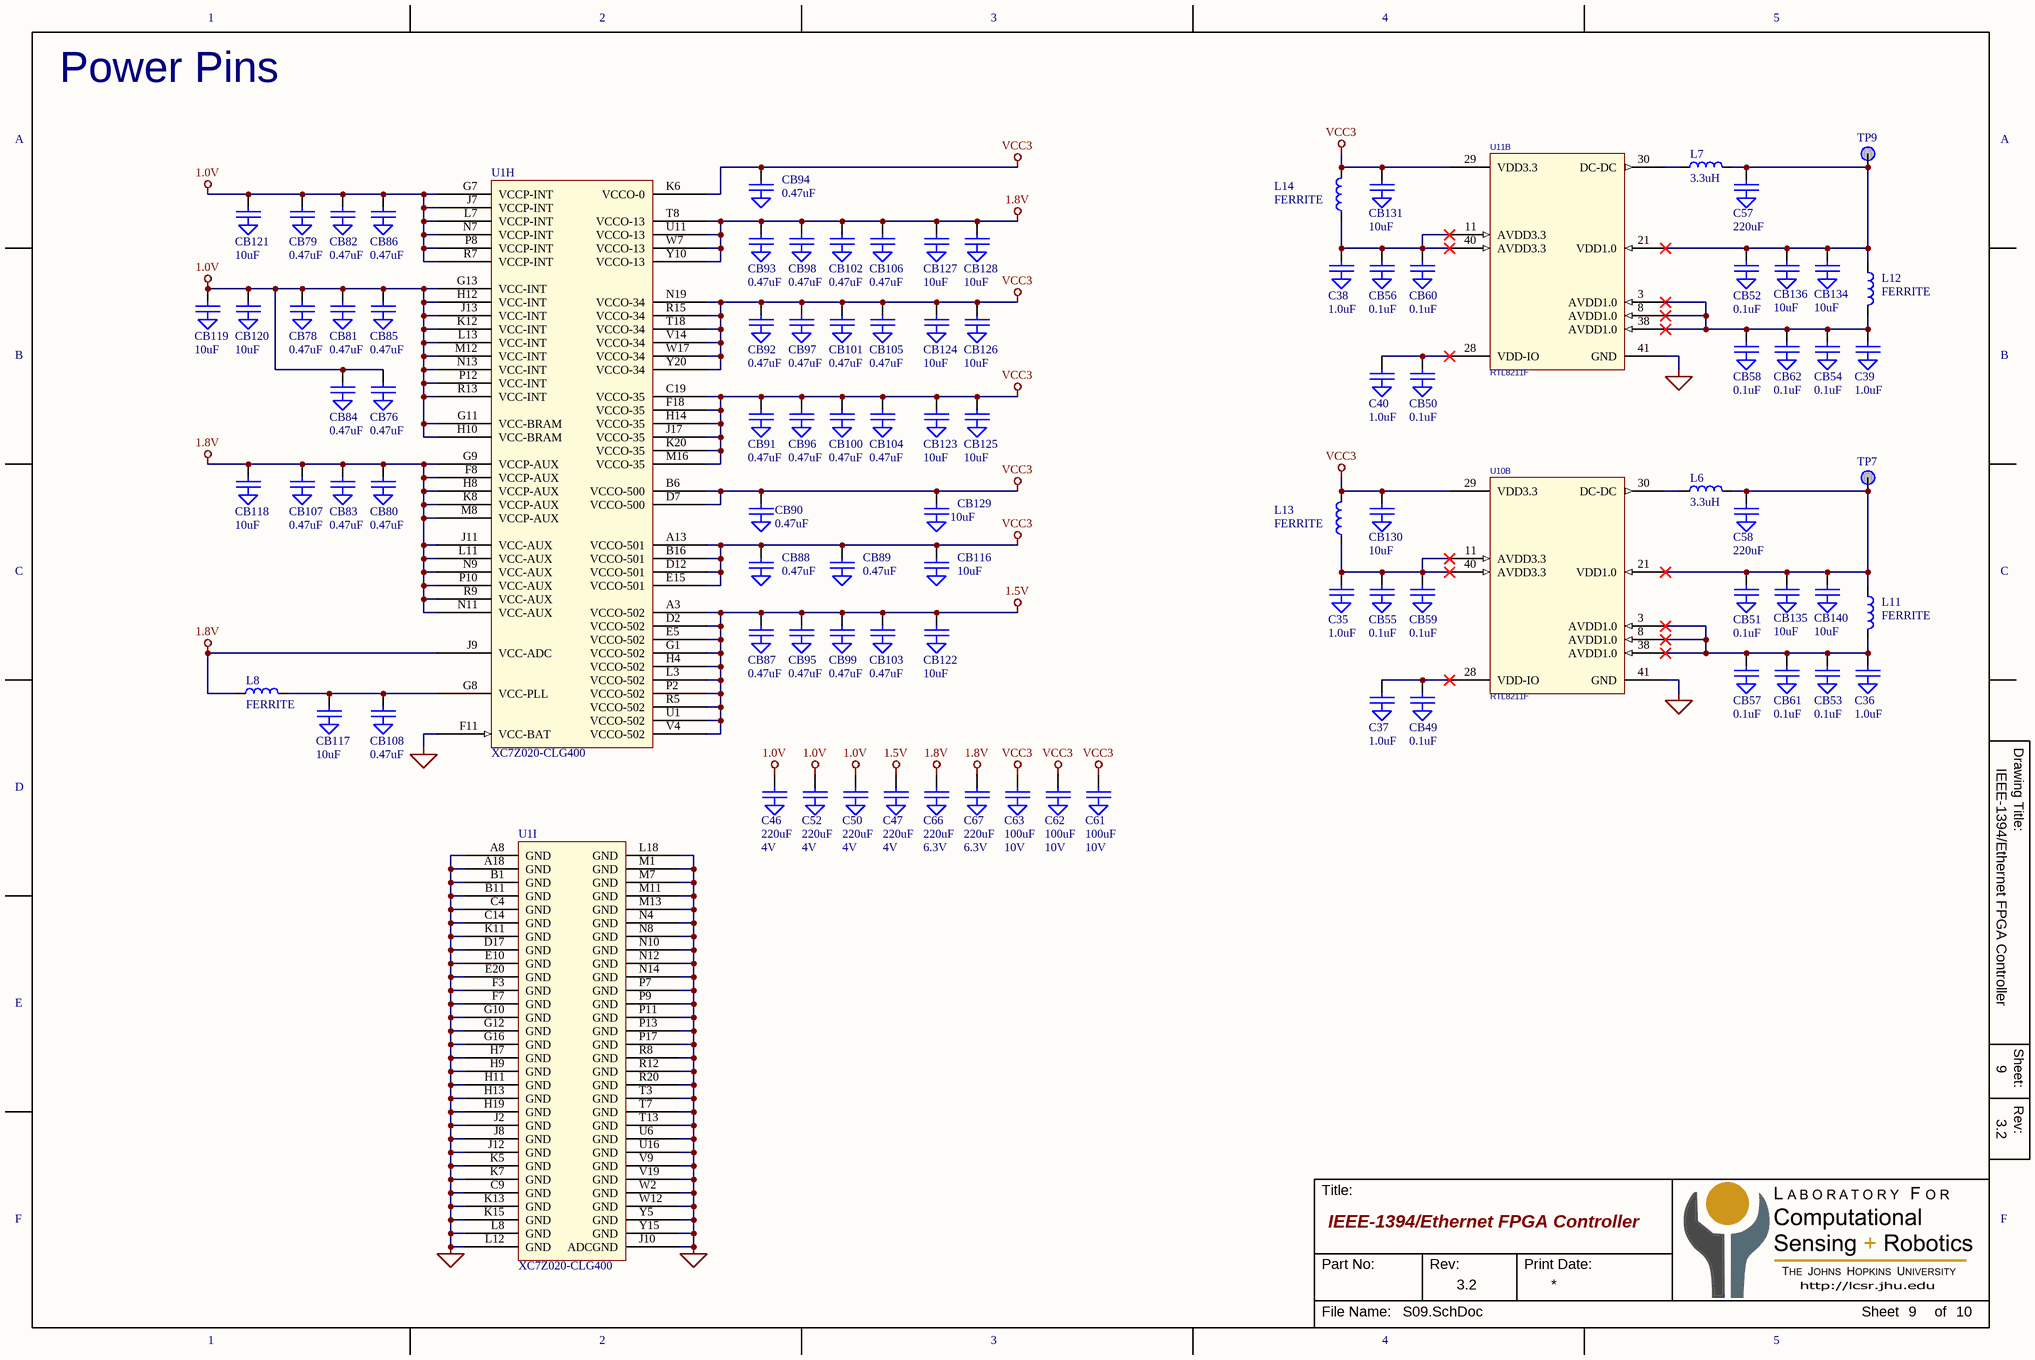
[diagram p8: S09.SchDoc]

### Parts
C35  1.0uF  [C0402]
C36  1.0uF  [C0402]
C37  1.0uF  [C0402]
C38  1.0uF  [C0402]
C39  1.0uF  [C0402]
C40  1.0uF  [C0402]
C46  220uF  Parameter 1: 4V  [C1206]
C47  220uF  Parameter 1: 4V  [C1206]
C50  220uF  Parameter 1: 4V  [C1206]
C52  220uF  Parameter 1: 4V  [C1206]
C57  220uF  [C1206]
C58  220uF  [C1206]
C61  100uF  Parameter 1: 10V  [C1210]
C62  100uF  Parameter 1: 10V  [C1210]
C63  100uF  Parameter 1: 10V  [C1210]
C66  220uF  Parameter 1: 6.3V  [C1210]
C67  220uF  Parameter 1: 6.3V  [C1210]
CB49  0.1uF  [C0201]
CB50  0.1uF  [C0201]
CB51  0.1uF  [C0201]
CB52  0.1uF  [C0201]
CB53  0.1uF  [C0201]
CB54  0.1uF  [C0201]
CB55  0.1uF  [C0201]
CB56  0.1uF  [C0201]
CB57  0.1uF  [C0201]
CB58  0.1uF  [C0201]
CB59  0.1uF  [C0201]
CB60  0.1uF  [C0201]
CB61  0.1uF  [C0201]
CB62  0.1uF  [C0201]
CB76  0.47uF  [CB0402]
CB78  0.47uF  [CB0402]
CB79  0.47uF  [CB0402]
CB80  0.47uF  [CB0402]
CB81  0.47uF  [CB0402]
CB82  0.47uF  [CB0402]
CB83  0.47uF  [CB0402]
CB84  0.47uF  [CB0402]
CB85  0.47uF  [CB0402]
CB86  0.47uF  [CB0402]
CB87  0.47uF  [CB0402]
CB88  0.47uF  [CB0402]
CB89  0.47uF  [CB0402]
CB90  0.47uF  [CB0402]
CB91  0.47uF  [CB0402]
CB92  0.47uF  [CB0402]
CB93  0.47uF  [CB0402]
CB94  0.47uF  [CB0402]
CB95  0.47uF  [CB0402]
CB96  0.47uF  [CB0402]
CB97  0.47uF  [CB0402]
CB98  0.47uF  [CB0402]
CB99  0.47uF  [CB0402]
CB100  0.47uF  [CB0402]
CB101  0.47uF  [CB0402]
CB102  0.47uF  [CB0402]
CB103  0.47uF  [CB0402]
CB104  0.47uF  [CB0402]
CB105  0.47uF  [CB0402]
CB106  0.47uF  [CB0402]
CB107  0.47uF  [CB0402]
CB108  0.47uF  [CB0402]
CB116  10uF  [CB0603]
CB117  10uF  [CB0603]
CB118  10uF  [CB0603]
CB119  10uF  [CB0603]
CB120  10uF  [CB0603]
CB121  10uF  [CB0603]
CB122  10uF  [CB0603]
CB123  10uF  [CB0603]
CB124  10uF  [CB0603]
CB125  10uF  [CB0603]
CB126  10uF  [CB0603]
CB127  10uF  [CB0603]
CB128  10uF  [CB0603]
CB129  10uF  [CB0603]
CB130  10uF  [CB0603]
CB131  10uF  [CB0603]
CB134  10uF  [CB0603]
CB135  10uF  [CB0603]
CB136  10uF  [CB0603]
CB140  10uF  [CB0603]
L6  3.3uH  [INDUCTOR-EPL2014]
L7  3.3uH  [INDUCTOR-EPL2014]
L8  FERRITE  [L0603]
L11  FERRITE  [l0402]
L12  FERRITE  [l0402]
L13  FERRITE  [l0402]
L14  FERRITE  [l0402]
TP7  PAD  [PAD25-SM]  (value not drawn)  (no BOM)
TP9  PAD  [PAD25-SM]  (value not drawn)  (no BOM)
U1  XC7Z020-CLG400  [BGA-400-08mm]  (parts H,I of 9)
U10  RTL8211F  [QFN-40-5MM]  (part B of 2)
U11  RTL8211F  [QFN-40-5MM]  (part B of 2)

### Nets
1.0V: C46.1 C50.1 C52.1 CB76.1 CB78.1 CB79.1 CB81.1 CB82.1 CB84.1 CB85.1 CB86.1 CB119.1 CB120.1 CB121.1 U1.G7(VCCP-INT) U1.G11(VCC-BRAM) U1.G13(VCC-INT) U1.H10(VCC-BRAM) U1.H12(VCC-INT) U1.J7(VCCP-INT) U1.J13(VCC-INT) U1.K12(VCC-INT) U1.L7(VCCP-INT) U1.L13(VCC-INT) U1.M12(VCC-INT) U1.N7(VCCP-INT) U1.N13(VCC-INT) U1.P8(VCCP-INT) U1.P12(VCC-INT) U1.R7(VCCP-INT) U1.R13(VCC-INT)
1.5V: C47.1 CB87.1 CB95.1 CB99.1 CB103.1 CB122.1 U1.A3(VCCO-502) U1.D2(VCCO-502) U1.E5(VCCO-502) U1.G1(VCCO-502) U1.H4(VCCO-502) U1.L3(VCCO-502) U1.P2(VCCO-502) U1.R5(VCCO-502) U1.U1(VCCO-502) U1.V4(VCCO-502)
1.8V: C66.1 C67.1 CB80.1 CB83.1 CB93.1 CB98.1 CB102.1 CB106.1 CB107.1 CB118.1 CB127.1 CB128.1 L8.1 U1.F8(VCCP-AUX) U1.G9(VCCP-AUX) U1.H8(VCCP-AUX) U1.J9(VCC-ADC) U1.J11(VCC-AUX) U1.K8(VCCP-AUX) U1.L11(VCC-AUX) U1.M8(VCCP-AUX) U1.N9(VCC-AUX) U1.N11(VCC-AUX) U1.P10(VCC-AUX) U1.R9(VCC-AUX) U1.T8(VCCO-13) U1.U11(VCCO-13) U1.W7(VCCO-13) U1.Y10(VCCO-13)
GND: C35.2(GND) C36.2(GND) C37.2(GND) C38.2(GND) C39.2(GND) C40.2(GND) C46.2(GND) C47.2(GND) C50.2(GND) C52.2(GND) C57.2(GND) C58.2(GND) C61.2(GND) C62.2(GND) C63.2(GND) C66.2(GND) C67.2(GND) CB49.2(GND) CB50.2(GND) CB51.2(GND) CB52.2(GND) CB53.2(GND) CB54.2(GND) CB55.2(GND) CB56.2(GND) CB57.2(GND) CB58.2(GND) CB59.2(GND) CB60.2(GND) CB61.2(GND) CB62.2(GND) CB76.2(GND) CB78.2(GND) CB79.2(GND) CB80.2(GND) CB81.2(GND) CB82.2(GND) CB83.2(GND) CB84.2(GND) CB85.2(GND) CB86.2(GND) CB87.2(GND) CB88.2(GND) CB89.2(GND) CB90.2(GND) CB91.2(GND) CB92.2(GND) CB93.2(GND) CB94.2(GND) CB95.2(GND) CB96.2(GND) CB97.2(GND) CB98.2(GND) CB99.2(GND) CB100.2(GND) CB101.2(GND) CB102.2(GND) CB103.2(GND) CB104.2(GND) CB105.2(GND) CB106.2(GND) CB107.2(GND) CB108.2(GND) CB116.2(GND) CB117.2(GND) CB118.2(GND) CB119.2(GND) CB120.2(GND) CB121.2(GND) CB122.2(GND) CB123.2(GND) CB124.2(GND) CB125.2(GND) CB126.2(GND) CB127.2(GND) CB128.2(GND) CB129.2(GND) CB130.2(GND) CB131.2(GND) CB134.2(GND) CB135.2(GND) CB136.2(GND) CB140.2(GND) U1.A8(GND) U1.A18(GND) U1.B1(GND) U1.B11(GND) U1.C4(GND) U1.C9(GND) U1.C14(GND) U1.D17(GND) U1.E10(GND) U1.E20(GND) U1.F3(GND) U1.F7(GND) U1.F11(VCC-BAT) U1.G10(GND) U1.G12(GND) U1.G16(GND) U1.H7(GND) U1.H9(GND) U1.H11(GND) U1.H13(GND) U1.H19(GND) U1.J2(GND) U1.J8(GND) U1.J10(ADCGND) U1.J12(GND) U1.K5(GND) U1.K7(GND) U1.K11(GND) U1.K13(GND) U1.K15(GND) U1.L8(GND) U1.L12(GND) U1.L18(GND) U1.M1(GND) U1.M7(GND) U1.M11(GND) U1.M13(GND) U1.N4(GND) U1.N8(GND) U1.N10(GND) U1.N12(GND) U1.N14(GND) U1.P7(GND) U1.P9(GND) U1.P11(GND) U1.P13(GND) U1.P17(GND) U1.R8(GND) U1.R12(GND) U1.R20(GND) U1.T3(GND) U1.T7(GND) U1.T13(GND) U1.U6(GND) U1.U16(GND) U1.V9(GND) U1.V19(GND) U1.W2(GND) U1.W12(GND) U1.Y5(GND) U1.Y15(GND) U10.41(GND) U11.41(GND)
VCC3: C61.1 C62.1 C63.1 CB88.1 CB89.1 CB90.1 CB91.1 CB92.1 CB94.1 CB96.1 CB97.1 CB100.1 CB101.1 CB104.1 CB105.1 CB116.1 CB123.1 CB124.1 CB125.1 CB126.1 CB129.1 CB130.1 CB131.1 L13.2 L14.2 U1.A13(VCCO-501) U1.B6(VCCO-500) U1.B16(VCCO-501) U1.C19(VCCO-35) U1.D7(VCCO-500) U1.D12(VCCO-501) U1.E15(VCCO-501) U1.F18(VCCO-35) U1.H14(VCCO-35) U1.J17(VCCO-35) U1.K6(VCCO-0) U1.K20(VCCO-35) U1.M16(VCCO-35) U1.N19(VCCO-34) U1.R15(VCCO-34) U1.T18(VCCO-34) U1.V14(VCCO-34) U1.W17(VCCO-34) U1.Y20(VCCO-34) U10.29(VDD3.3) U11.29(VDD3.3)
NetC35_1: C35.1 CB55.1 CB59.1 L13.1 U10.11(AVDD3.3) U10.40(AVDD3.3)
NetC36_1: C36.1 CB53.1 CB57.1 CB61.1 L11.2 U10.3(AVDD1.0) U10.8(AVDD1.0) U10.38(AVDD1.0)
NetC37_1: C37.1 CB49.1 U10.28(VDD-IO)
NetC38_1: C38.1 CB56.1 CB60.1 L14.1 U11.11(AVDD3.3) U11.40(AVDD3.3)
NetC39_1: C39.1 CB54.1 CB58.1 CB62.1 L12.2 U11.3(AVDD1.0) U11.8(AVDD1.0) U11.38(AVDD1.0)
NetC40_1: C40.1 CB50.1 U11.28(VDD-IO)
NetC57_1: C57.1 CB52.1 CB134.1 CB136.1 L7.2 L12.1 TP9.1 U11.21(VDD1.0)
NetC58_1: C58.1 CB51.1 CB135.1 CB140.1 L6.2 L11.1 TP7.1 U10.21(VDD1.0)
NetCB108_1: CB108.1 CB117.1 L8.2 U1.G8(VCC-PLL)
NetL6_1: L6.1 U10.30(DC-DC)
NetL7_1: L7.1 U11.30(DC-DC)

### Notes on the sheet
- Power Pins
- 1
- 2
- 3
- 4
- 5
- A
- B
- C
- Drawing Title:
- D
- E
- Sheet:
- Rev:
- F
- Title:
- Part No:
- Print Date:
- File Name:
- Sheet
- of

### Library data of the parts
C35-C40 C46 C47 C50 C52 C57 C58 C61-C63 C66 C67 CB49-CB62 CB76 CB78-CB108 CB116-CB131 CB134-CB136 CB140 = CAP-GND
L6-L8 L11-L14 = INDUCTOR
U10 U11 = RTL8211F: Ethernet PHY

## Sheet S10.SchDoc: IEEE-1394/Ethernet FPGA Controller
size 381 x 254 mm; Revision: 3.2; SheetNumber: 10; SheetTotal: 10
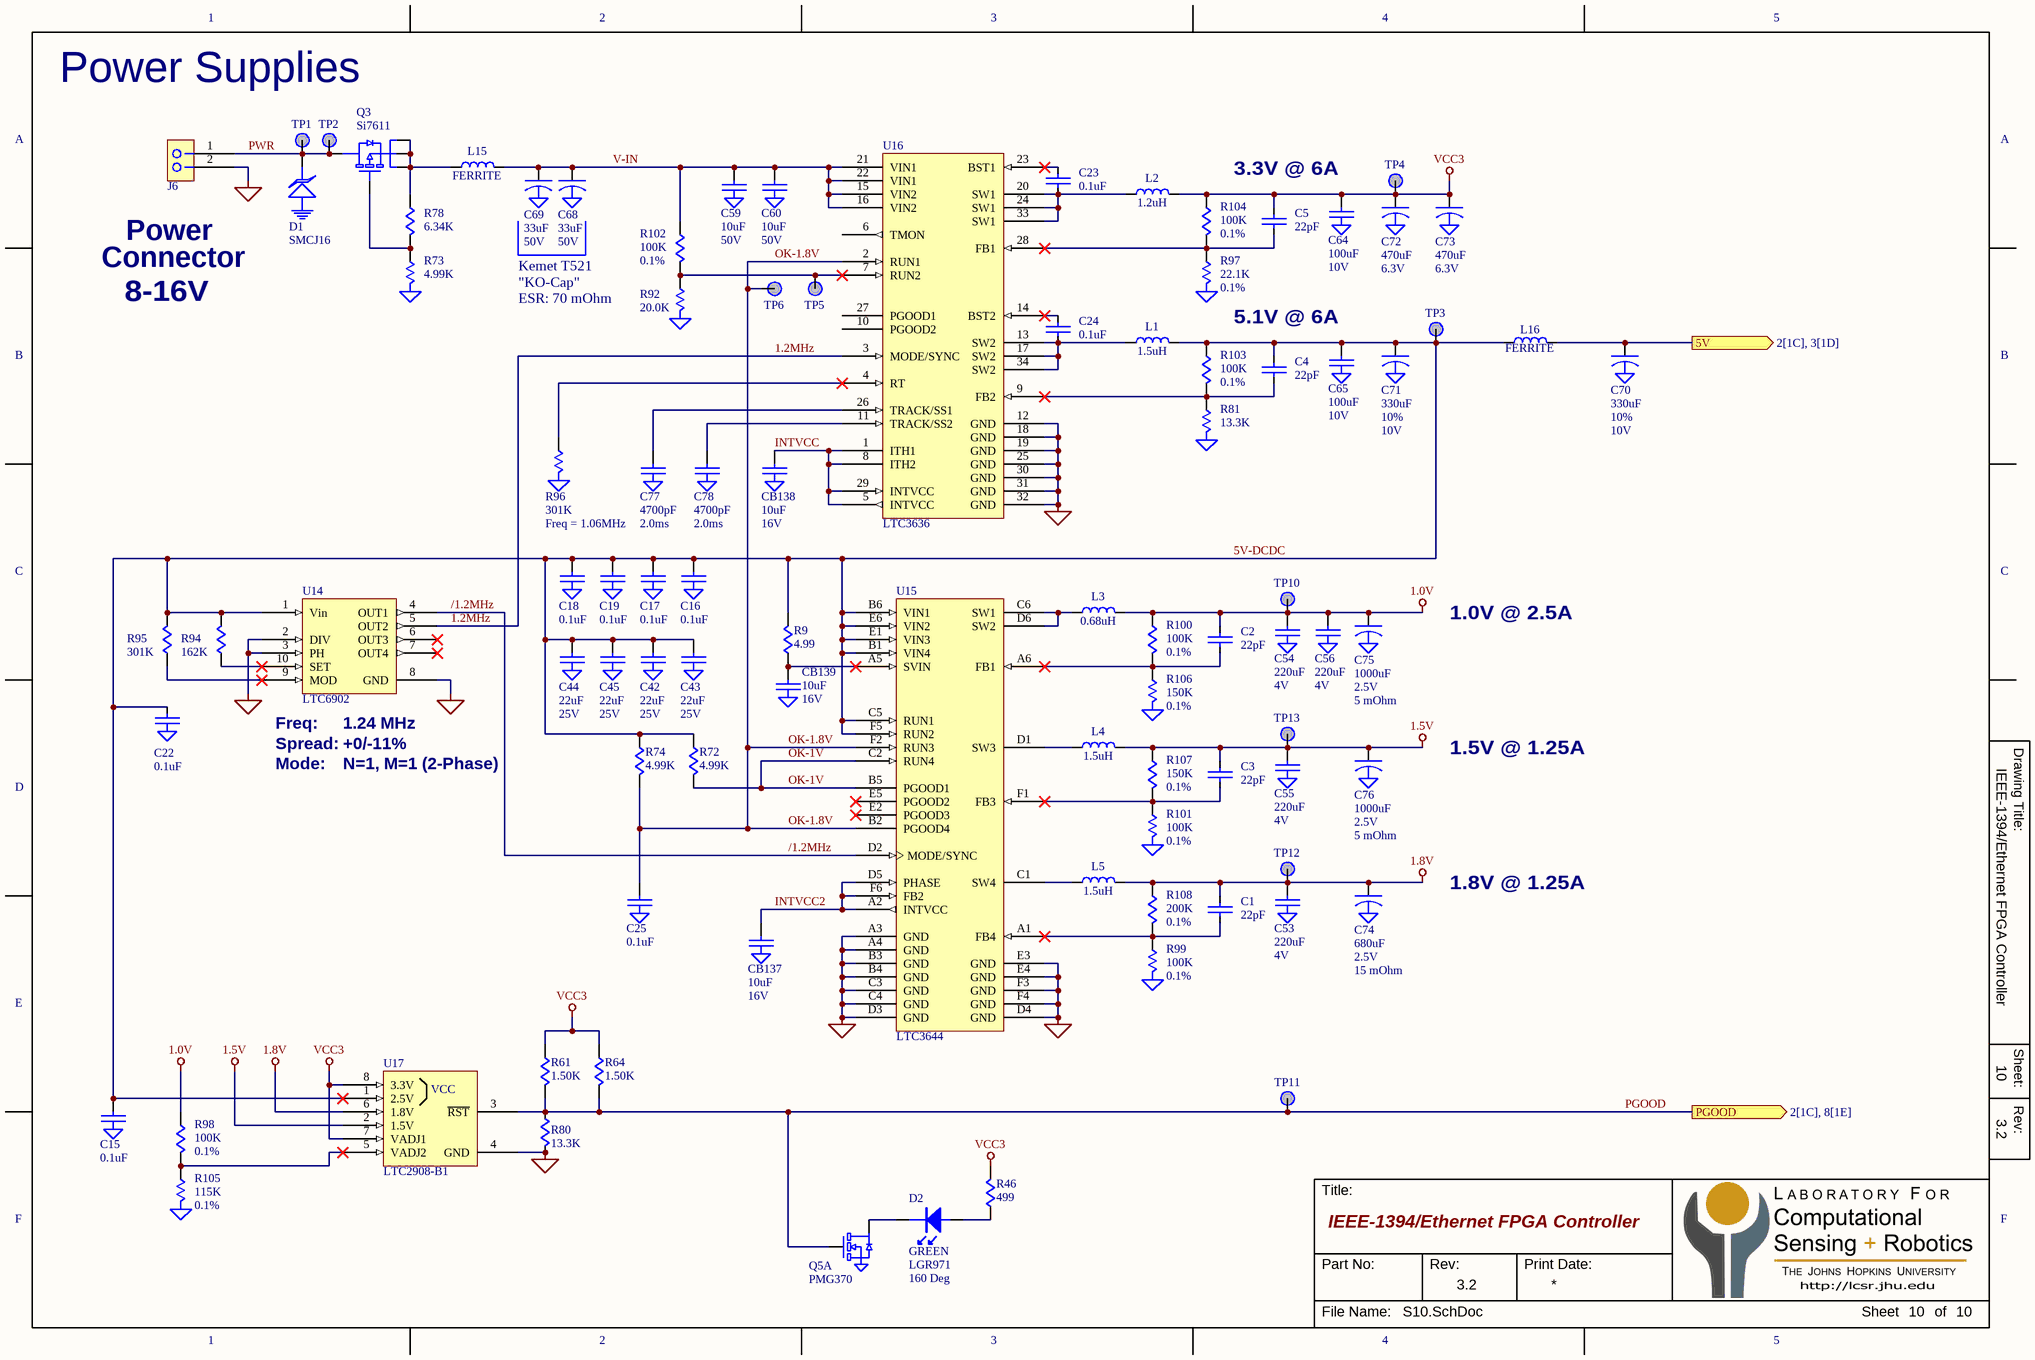
[diagram p9: S10.SchDoc]

### Parts
C1  22pF  [C0402]
C2  22pF  [C0402]
C3  22pF  [C0402]
C4  22pF  [C0402]
C5  22pF  [C0402]
C15  0.1uF  [C0402]
C16  0.1uF  [C0402]
C17  0.1uF  [C0402]
C18  0.1uF  [C0402]
C19  0.1uF  [C0402]
C22  0.1uF  [C0402]
C23  0.1uF  [C0402]
C24  0.1uF  [C0402]
C25  0.1uF  [C0402]
C42  22uF  [C0805]
C43  22uF  [C0805]
C44  22uF  [C0805]
C45  22uF  [C0805]
C53  220uF  [C1206]
C54  220uF  [C1206]
C55  220uF  [C1206]
C56  220uF  [C1206]
C59  10uF  [C1210]
C60  10uF  [C1210]
C64  100uF  [C1210]
C65  100uF  [C1210]
C68  33uF  Voltage: 50V  [CAP-D-31]
C69  33uF  Voltage: 50V  [CAP-D-31]
C70  330uF  Voltage: 10V  Tol: 10%  [CAP-D-31]
C71  330uF  Voltage: 10V  Tol: 10%  [CAP-D-31]
C72  470uF  Volts: 6.3V  [CAP-D-31]
C73  470uF  Volts: 6.3V  [CAP-D-31]
C74  680uF  Voltage: 2.5V  ESR: 15 mOhm  [CAP-D-43]
C75  1000uF  Voltage: 2.5V  ESR: 5 mOhm  [CAP-D-43]
C76  1000uF  Voltage: 2.5V  ESR: 5 mOhm  [CAP-D-43]
C77  4700pF  Parameter 1: 2.0ms  [C0402]
C78  4700pF  Parameter 1: 2.0ms  [C0402]
CB137  10uF  [CB0603]
CB138  10uF  [CB0603]
CB139  10uF  [CB0603]
D1  SMCJ16  [DIODE-SMC]
D2  Color: GREEN  P/N: LGR971  Angle: 160 Deg  [LED-0805]  (hidden comment: LED)
J6  HEADER 2  [HDR-2x1-100]  (value not drawn)
L1  1.5uH  [INDUCTOR-XGL5030]
L2  1.2uH  [INDUCTOR-XGL5030]
L3  0.68uH  [INDUCTOR-XAL4040]
L4  1.5uH  [INDUCTOR-XAL4040]
L5  1.5uH  [INDUCTOR-XAL4040]
L15  FERRITE  [R1206]
L16  FERRITE  [R1206]
Q3  Si7611  [PowerPak-1212]
Q5  PMG370  [SC70-6-NP]  (part A of 2)
R9  4.99  [R0402]
R46  499  [R0402]
R61  1.50K  [R0402]
R64  1.50K  [R0402]
R72  4.99K  [R0402]
R73  4.99K  [R0402]
R74  4.99K  [R0402]
R78  6.34K  [R0402]
R80  13.3K  [R0402]
R81  13.3K  [R0402]
R92  20.0K  [R0402]
R94  162K  [R0402]
R95  301K  [R0402]
R96  301K  Parameter 1: Freq = 1.06MHz  [R0402]
R97  22.1K  [R0402]
R98  100K  Parameter 1: 0.1%  [R0402]
R99  100K  [R0402]
R100  100K  Parameter 1: 0.1%  [R0402]
R101  100K  [R0402]
R102  100K  [R0402]
R103  100K  Parameter 1: 0.1%  [R0402]
R104  100K  Parameter 1: 0.1%  [R0402]
R105  115K  [R0402]
R106  150K  [R0402]
R107  150K  Parameter 1: 0.1%  [R0402]
R108  200K  [R0402]
TP1  PAD  [PAD25-SM]  (value not drawn)  (no BOM)
TP2  PAD  [PAD25-SM]  (value not drawn)  (no BOM)
TP3  PAD  [PAD25-SM]  (value not drawn)  (no BOM)
TP4  PAD  [PAD25-SM]  (value not drawn)  (no BOM)
TP5  PAD  [PAD25-SM]  (value not drawn)  (no BOM)
TP6  PAD  [PAD25-SM]  (value not drawn)  (no BOM)
TP10  PAD  [PAD25-SM]  (value not drawn)  (no BOM)
TP11  PAD  [PAD25-SM]  (value not drawn)  (no BOM)
TP12  PAD  [PAD25-SM]  (value not drawn)  (no BOM)
TP13  PAD  [PAD25-SM]  (value not drawn)  (no BOM)
U14  LTC6902  [MSOP-10]
U15  LTC3644  [BGA-36-08mm]
U16  LTC3636  [QFN-28-LTC3636]
U17  LTC2908-B1  [SOT-23-8]

### Ports
5V (out, see 2[1C], 3[1D]), PGOOD (out, see 2[1C], 8[1E])

### Nets
1.0V: C2.1 C54.1 C56.1 C75.1 L3.2 R98.1 R100.1 TP10.1
1.5V: C3.1 C55.1 C76.1 L4.2 R107.1 TP13.1 U17.2(1.5V)
1.8V: C1.1 C53.1 C74.1 L5.2 R108.1 TP12.1 U17.6(1.8V)
GND: C15.2(GND) C16.2(GND) C17.2(GND) C18.2(GND) C19.2(GND) C22.2(GND) C25.2(GND) C42.2(GND) C43.2(GND) C44.2(GND) C45.2(GND) C53.2(GND) C54.2(GND) C55.2(GND) C56.2(GND) C59.2(GND) C60.2(GND) C64.2(GND) C65.2(GND) C68.2(GND) C69.2(GND) C70.2(GND) C71.2(GND) C72.2(GND) C73.2(GND) C74.2(GND) C75.2(GND) C76.2(GND) C77.2(GND) C78.2(GND) CB137.2(GND) CB138.2(GND) CB139.2(GND) D1.2(GND) J6.2 Q5.1(S1) R73.2(GND) R80.2 R81.2(GND) R92.2(GND) R96.2(GND) R97.2(GND) R99.2(GND) R101.2(GND) R105.2(GND) R106.2(GND) U14.2(DIV) U14.3(PH) U14.8(GND) U15.A3(GND) U15.A4(GND) U15.B3(GND) U15.B4(GND) U15.C3(GND) U15.C4(GND) U15.D3(GND) U15.D4(GND) U15.E3(GND) U15.E4(GND) U15.F3(GND) U15.F4(GND) U16.12(GND) U16.18(GND) U16.19(GND) U16.25(GND) U16.30(GND) U16.31(GND) U16.32(GND) U17.4(GND)
VCC3: C5.1 C64.1 C72.1 C73.1 L2.2 R46.2 R61.1 R64.1 R104.1 TP4.1 U17.7(VADJ1) U17.8(3.3V)
1.2MHz: U14.5(OUT2) U16.3(MODE/SYNC)  [project net 1.2MHz_10]
5V: C70.1 L16.2 ; port 5V
5V-DCDC: C4.1 C15.1 C16.1 C17.1 C18.1 C19.1 C22.1 C42.1 C43.1 C44.1 C45.1 C65.1 C71.1 L1.2 L16.1 R9.2 R72.1 R74.1 R94.2 R95.2 R103.1 TP3.1 U14.1(Vin) U15.B1(VIN4) U15.B6(VIN1) U15.C5(RUN1) U15.E1(VIN3) U15.E6(VIN2) U15.F5(RUN2) U17.1(2.5V)  [project net 5V-DCDC_10]
/1.2MHz: U14.4(OUT1) U15.D2(MODE/SYNC)  [project net /1.2MHz_10]
INTVCC: CB138.1 U16.1(ITH1) U16.5(INTVCC) U16.8(ITH2) U16.29(INTVCC)  [project net INTVCC_10]
INTVCC2: CB137.1 U15.A2(INTVCC) U15.D5(PHASE) U15.F6(FB2)  [project net INTVCC2_10]
OK-1.8V: C25.1 R74.2 TP6.1 U15.B2(PGOOD4) U15.F2(RUN3) U16.2(RUN1)  [project net OK-1.8V_10]
OK-1V: R72.2 U15.B5(PGOOD1) U15.C2(RUN4)  [project net OK-1V_10]
PGOOD: Q5.2(G1) R61.2 R64.2 R80.1 TP11.1 U17.3(~{RST}) ; port PGOOD
PWR: D1.1 J6.1 Q3.5(D) TP1.1 TP2.1  [project net PWR_10]
V-IN: C59.1 C60.1 C68.1 C69.1 L15.2 R102.1 U16.15(VIN2) U16.16(VIN2) U16.21(VIN1) U16.22(VIN1)  [project net V-IN_10]
NetC1_2: C1.2 R99.1 R108.2 U15.A1(FB4)
NetC2_2: C2.2 R100.2 R106.1 U15.A6(FB1)
NetC3_2: C3.2 R101.1 R107.2 U15.F1(FB3)
NetC4_2: C4.2 R81.1 R103.2 U16.9(FB2)
NetC5_2: C5.2 R97.1 R104.2 U16.28(FB1)
NetC23_1: C23.1 U16.23(BST1)
NetC23_2: C23.2 L2.1 U16.20(SW1) U16.24(SW1) U16.33(SW1)
NetC24_1: C24.1 U16.14(BST2)
NetC24_2: C24.2 L1.1 U16.13(SW2) U16.17(SW2) U16.34(SW2)
NetC77_1: C77.1 U16.26(TRACK/SS1)
NetC78_1: C78.1 U16.11(TRACK/SS2)
NetCB139_1: CB139.1 R9.1 U15.A5(SVIN)
NetD2_1: D2.1(C) Q5.6(D1)
NetD2_2: D2.2(A) R46.1
NetL3_1: L3.1 U15.C6(SW1) U15.D6(SW2)
NetL4_1: L4.1 U15.D1(SW3)
NetL5_1: L5.1 U15.C1(SW4)
NetL15_1: L15.1 Q3.1(S) Q3.2(S) Q3.3(S) R78.1
NetQ3_4: Q3.4(G) R73.1 R78.2
NetR92_1: R92.1 R102.2 TP5.1 U16.7(RUN2)
NetR94_1: R94.1 U14.10(SET)
NetR95_1: R95.1 U14.9(MOD)
NetR96_1: R96.1 U16.4(RT)
NetR98_2: R98.2 R105.1 U17.5(VADJ2)

Not connected (* = marked no-connect by the designer): U14 6(OUT3)* 7(OUT4)*; U15 E2(PGOOD3)* E5(PGOOD2)*; U16 6(TMON) 10(PGOOD2) 27(PGOOD1)

### Notes on the sheet
- Power Supplies
- 3.3V @ 6A
- 8-16V
- (near J6) Power
- Connector
- Kemet T521
- ESR: 70 mOhm
- "KO-Cap"
- 5.1V @ 6A
- 1.0V @ 2.5A
- (near U14) Freq:
- Spread:
- Mode:
- (near U14) 1.24 MHz
- +0/-11%
- N=1, M=1 (2-Phase)
- 1.5V @ 1.25A
- 1.8V @ 1.25A
- 1
- 2
- 3
- 4
- 5
- A
- B
- C
- Drawing Title:
- D
- E
- Sheet:
- Rev:
- F
- Title:
- Part No:
- Print Date:
- File Name:
- Sheet
- of
- (in symbol CAP-GND) 4V; 25V; 16V; 10V; 50V
- (in symbol LTC2908-B1-SOT) VCC
- (in symbol R) 0.1%
- (in symbol R-GND) 0.1%

### Library data of the parts
C1-C5 C23 C24 = CAP
C15-C19 C22 C25 C42-C45 C53-C56 C59 C60 C64 C65 C77 C78 CB137-CB139 = CAP-GND
C68 C69 = CAP-POL-GND: Type: Tant
C70 C71 = CAP-POL-GND: Type: SpeedPower
C72 C73 = CAP-POL-GND
C74-C76 = CAP-POL-GND: Part #: Kemet: T530X158M2R5ATE005
D1 = TVS-GND
L1-L5 L15 L16 = INDUCTOR
Q3 = MOSFET-P-PPACK
Q5 = MOSFET-N-DUAL6
R9 R46 R61 R64 R72 R74 R78 R80 R94 R95 R98 R100 R102-R104 R107 R108 = R
R73 R81 R92 R96 R97 R99 R101 R105 R106 = R-GND
U17 = LTC2908-B1-SOT